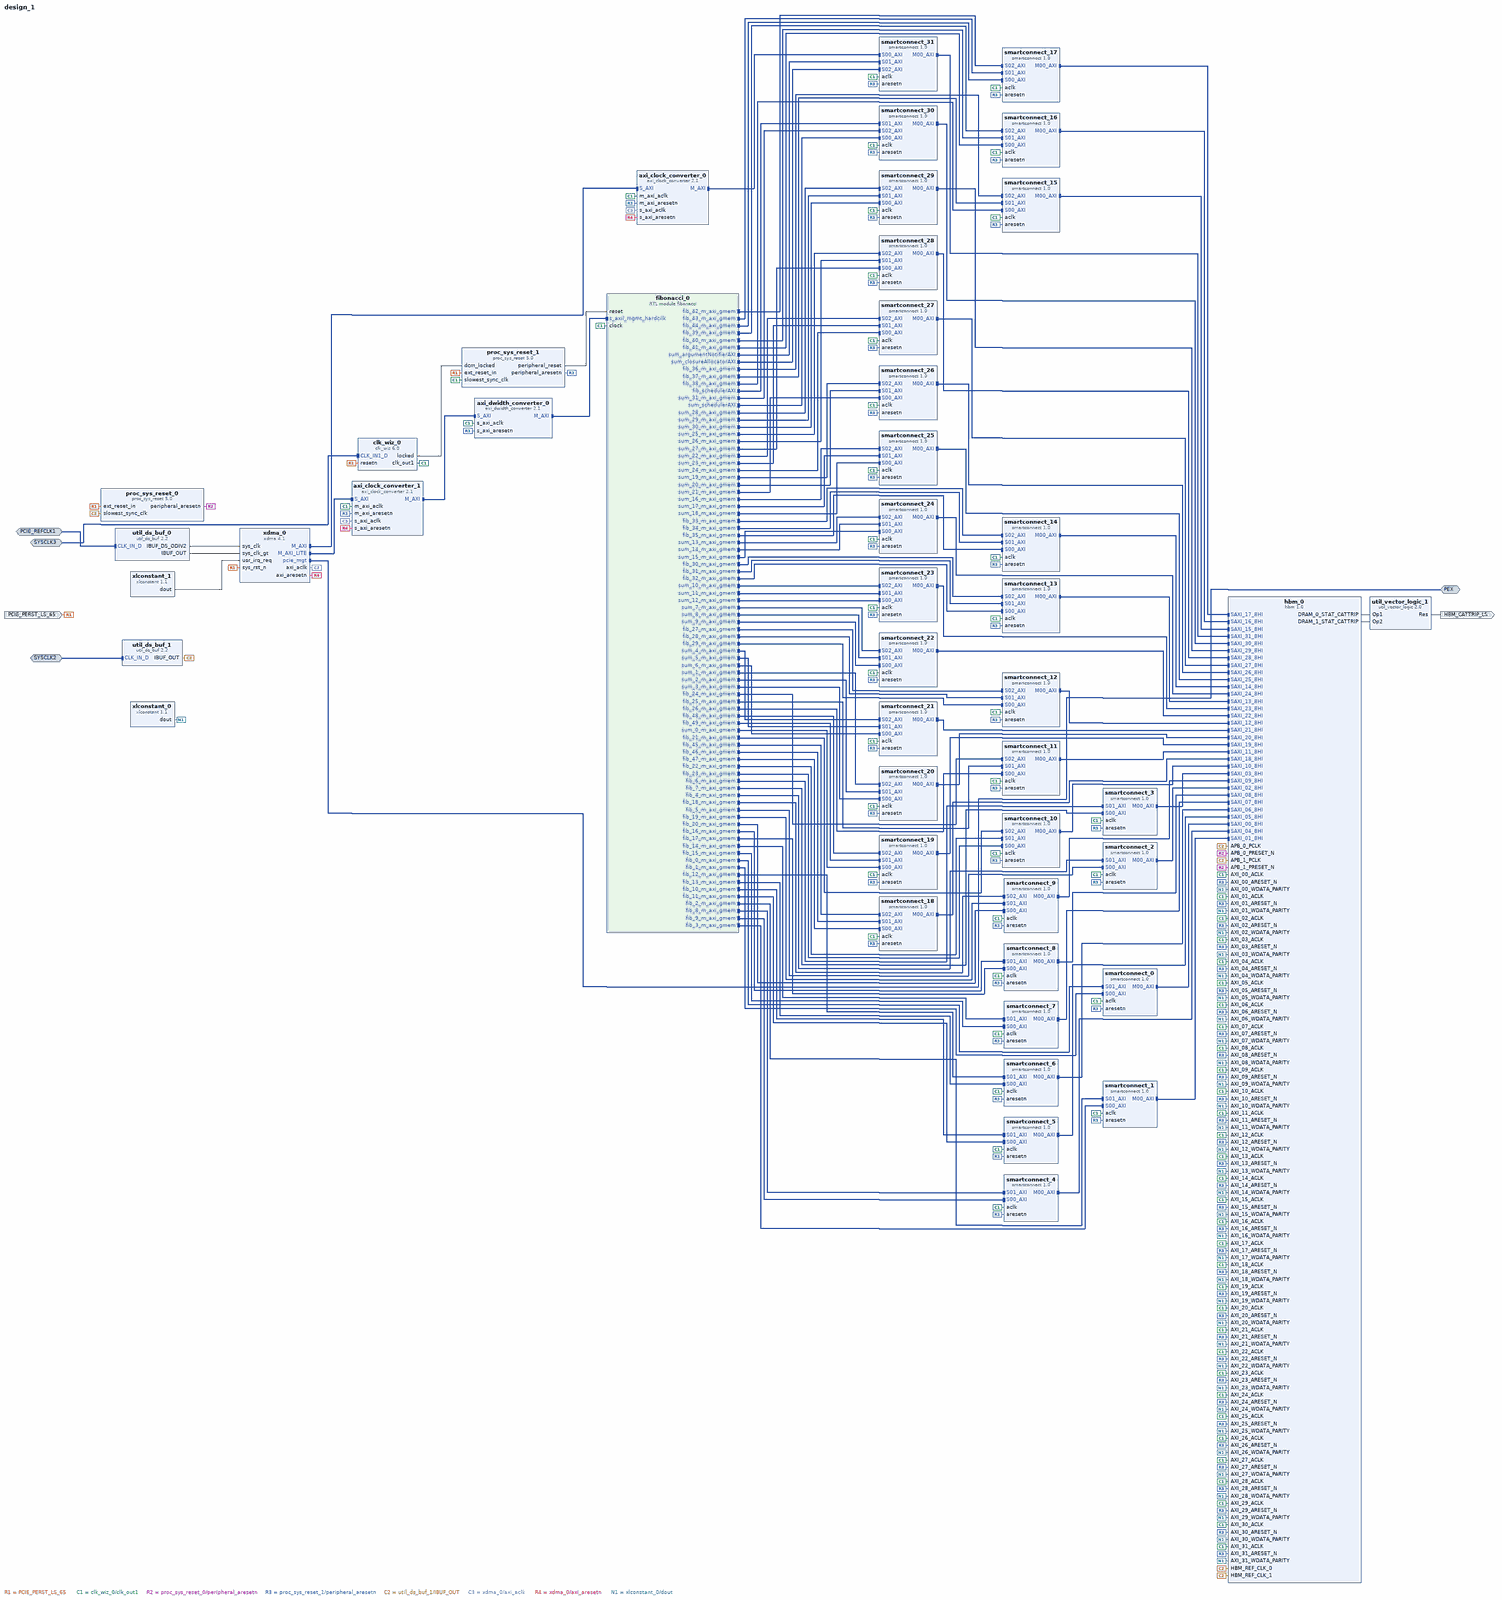
[diagram p0: block diagram of the top level, whole]
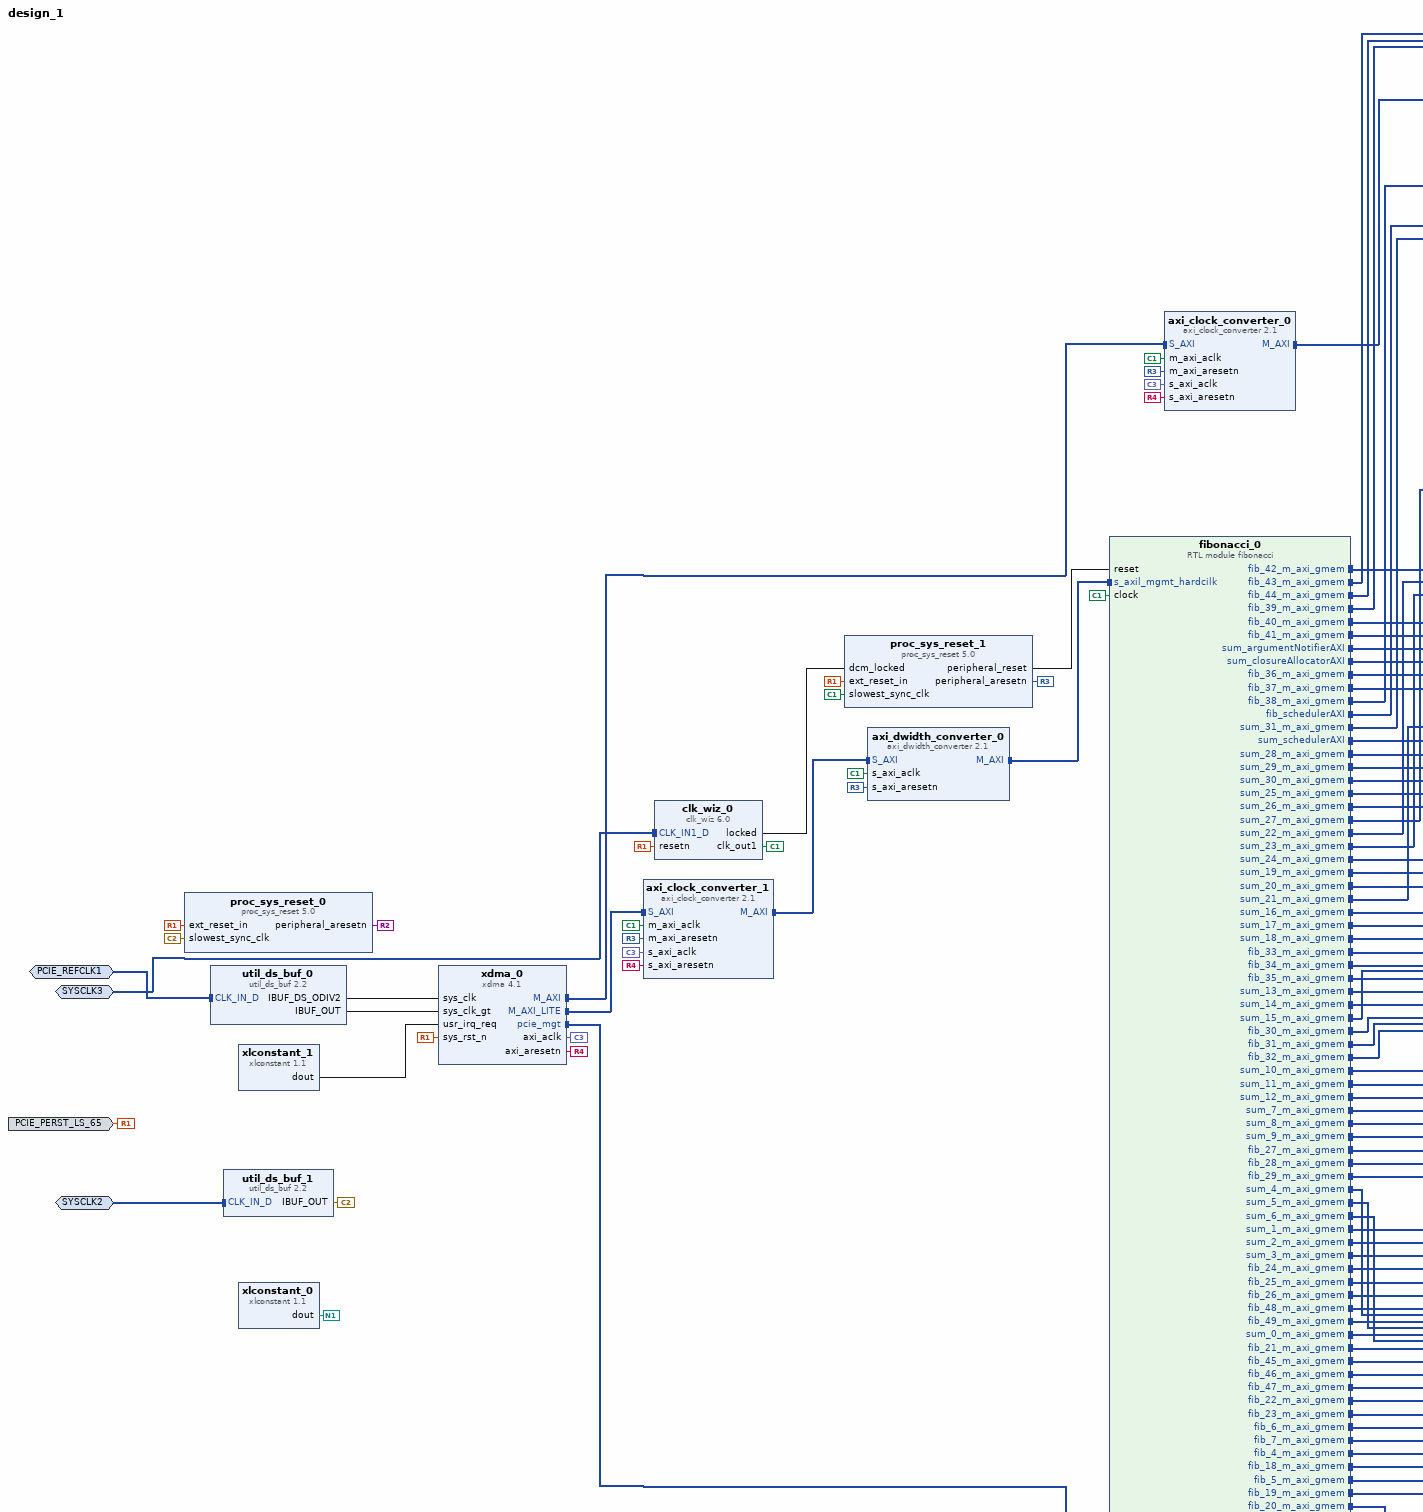
[diagram p1: block diagram of the top level, upper left part]
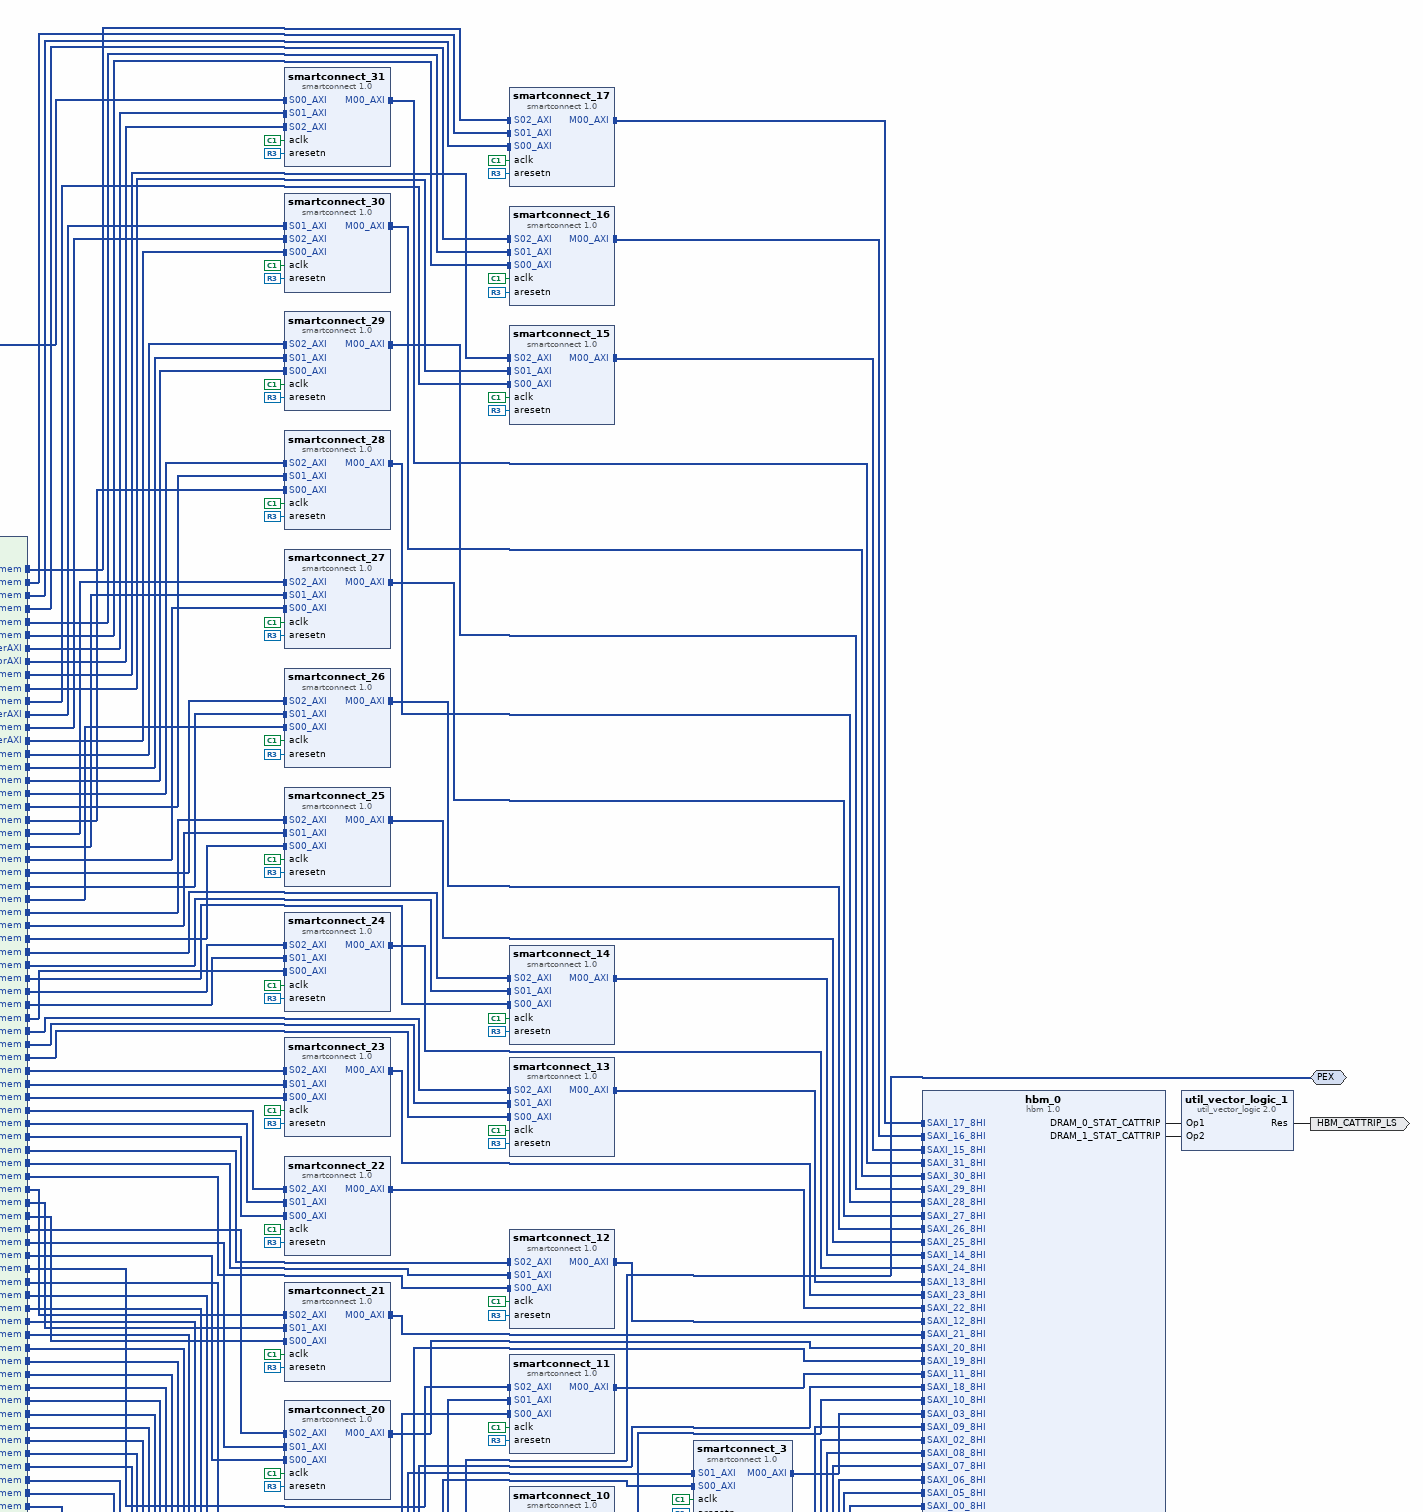
[diagram p2: block diagram of the top level, upper right part]
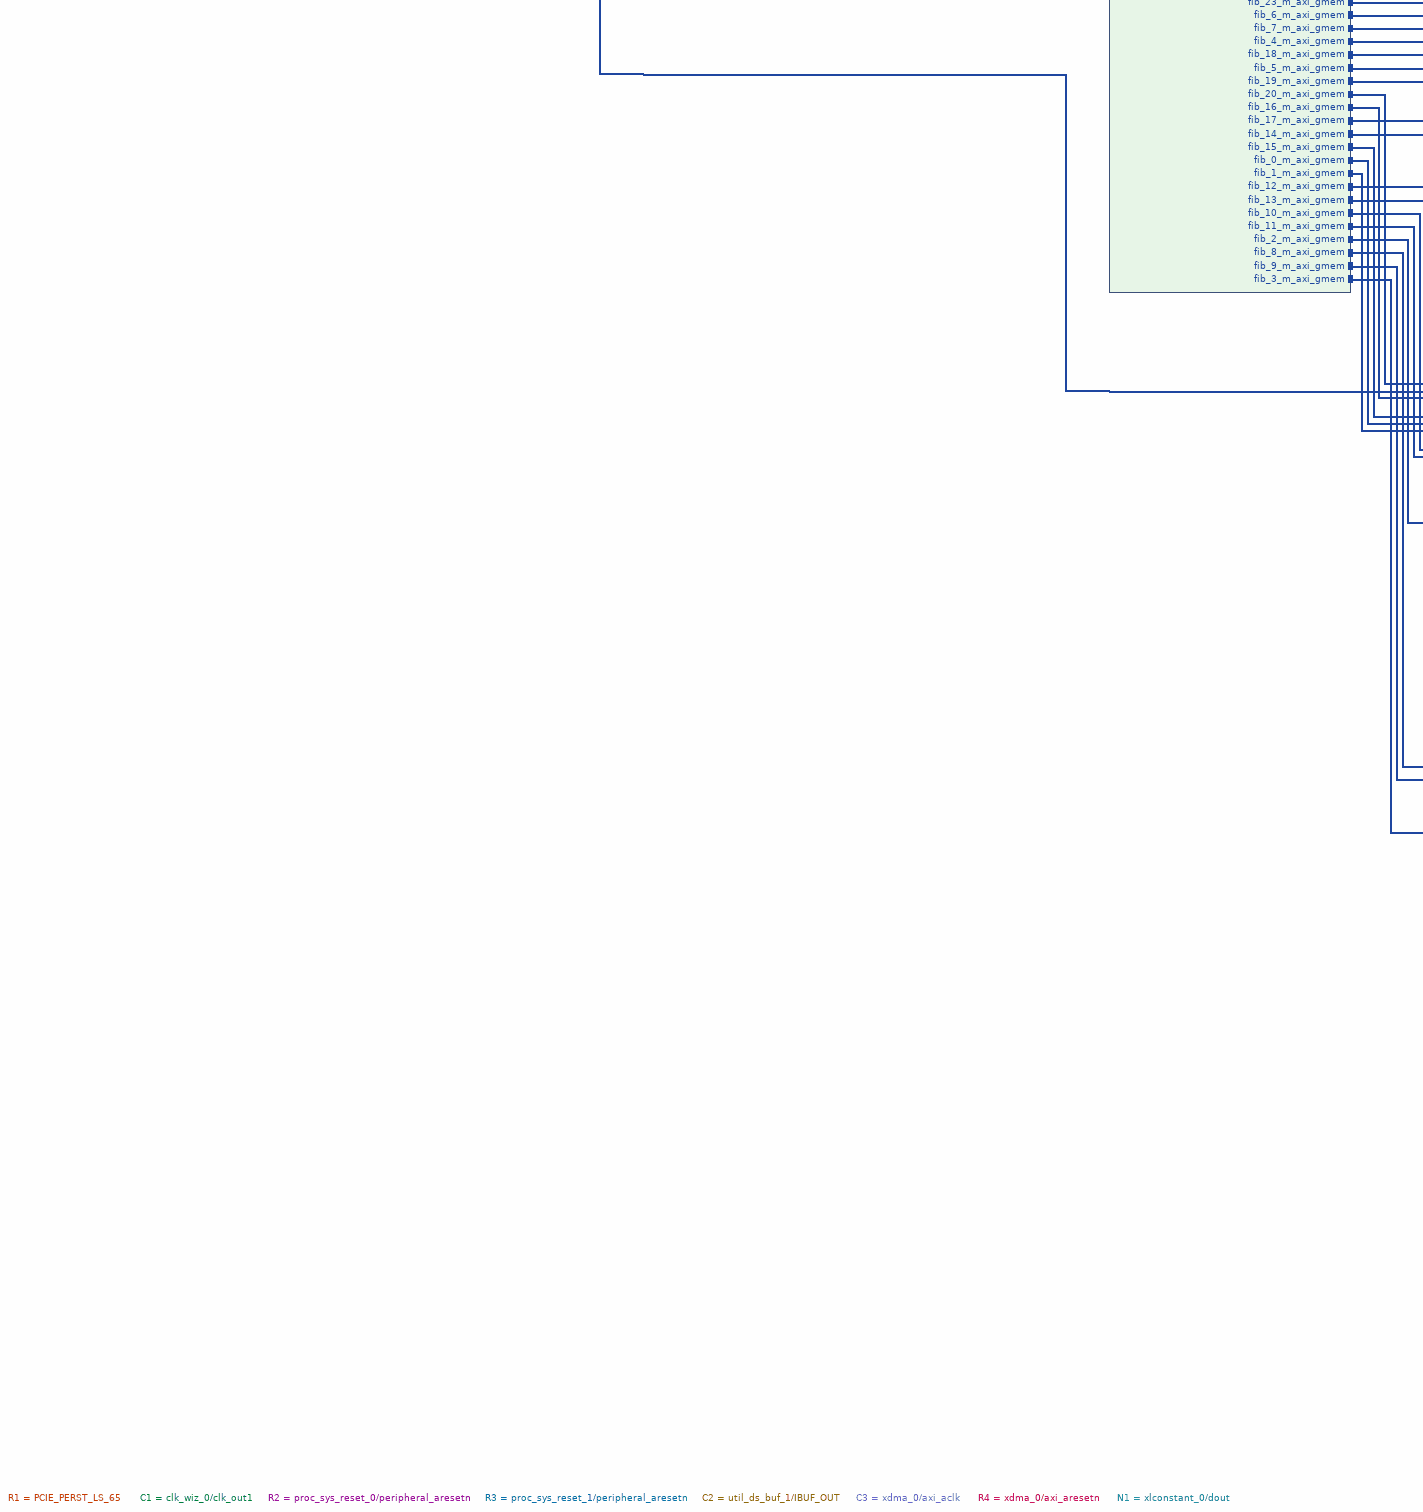
[diagram p3: block diagram of the top level, lower left part]
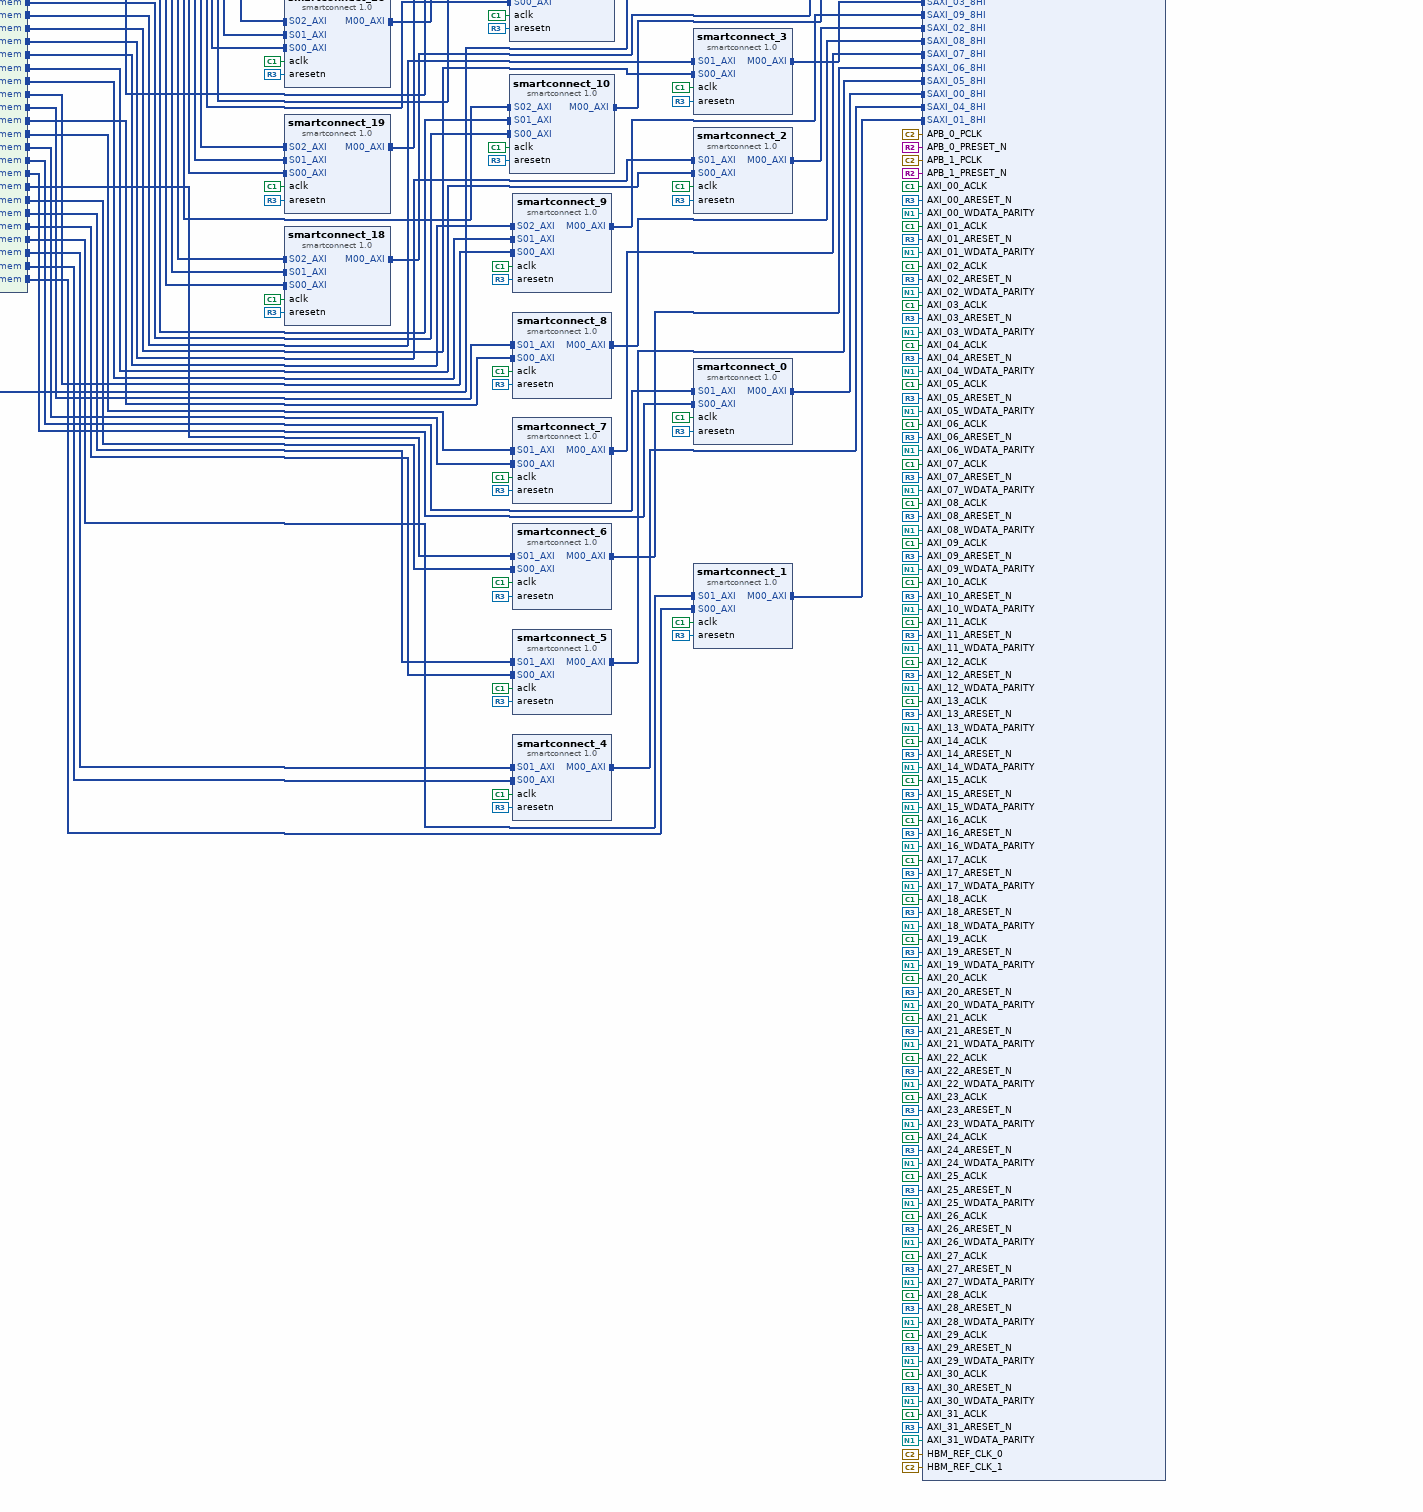
[diagram p4: block diagram of the top level, lower right part]
# Vivado block design design_1, xcu55c-fsvh2892-2L-e, Vivado 2024.1
create_bd_design design_1

create_bd_intf_port -mode Master -vlnv xilinx.com:interface:pcie_7x_mgt_rtl:1.0 PEX
create_bd_intf_port -mode Slave -vlnv xilinx.com:interface:diff_clock_rtl:1.0 PCIE_REFCLK1
create_bd_intf_port -mode Slave -vlnv xilinx.com:interface:diff_clock_rtl:1.0 SYSCLK2
create_bd_intf_port -mode Slave -vlnv xilinx.com:interface:diff_clock_rtl:1.0 SYSCLK3
create_bd_port -dir I -type rst PCIE_PERST_LS_65
create_bd_port -dir O HBM_CATTRIP_LS

create_bd_cell -type module -reference fibonacci fibonacci_0
create_bd_cell -type ip -vlnv xilinx.com:ip:xdma:4.1 xdma_0
set_property -dict [list \
  CONFIG.axil_master_64bit_en true \
  CONFIG.axilite_master_en true \
  CONFIG.axilite_master_scale Megabytes \
  CONFIG.axilite_master_size 4 \
  CONFIG.cfg_mgmt_if false \
  CONFIG.pl_link_cap_max_link_speed 8.0_GT/s \
  CONFIG.pl_link_cap_max_link_width X16 \
  CONFIG.xdma_pcie_64bit_en true \
] [get_bd_cells xdma_0]
create_bd_cell -type ip -vlnv xilinx.com:ip:xlconstant:1.1 xlconstant_1
set_property -dict {CONFIG.CONST_VAL 0} [get_bd_cells xlconstant_1]
create_bd_cell -type ip -vlnv xilinx.com:ip:util_ds_buf:2.2 util_ds_buf_0
set_property -dict {CONFIG.C_BUF_TYPE IBUFDSGTE} [get_bd_cells util_ds_buf_0]
create_bd_cell -type ip -vlnv xilinx.com:ip:axi_clock_converter:2.1 axi_clock_converter_0
create_bd_cell -type ip -vlnv xilinx.com:ip:axi_clock_converter:2.1 axi_clock_converter_1
create_bd_cell -type ip -vlnv xilinx.com:ip:hbm:1.0 hbm_0
set_property -dict [list \
  CONFIG.USER_APB_EN false \
  CONFIG.USER_HBM_DENSITY 16GB \
  CONFIG.USER_MC0_ECC_BYPASS true \
  CONFIG.USER_XSDB_INTF_EN FALSE \
] [get_bd_cells hbm_0]
create_bd_cell -type ip -vlnv xilinx.com:ip:xlconstant:1.1 xlconstant_0
set_property -dict {CONFIG.CONST_VAL 0 CONFIG.CONST_WIDTH 32} [get_bd_cells xlconstant_0]
create_bd_cell -type ip -vlnv xilinx.com:ip:util_vector_logic:2.0 util_vector_logic_1
set_property -dict {CONFIG.C_OPERATION or CONFIG.C_SIZE 1} [get_bd_cells util_vector_logic_1]
create_bd_cell -type ip -vlnv xilinx.com:ip:util_ds_buf:2.2 util_ds_buf_1
create_bd_cell -type ip -vlnv xilinx.com:ip:proc_sys_reset:5.0 proc_sys_reset_0
create_bd_cell -type ip -vlnv xilinx.com:ip:smartconnect:1.0 smartconnect_0
set_property -dict {CONFIG.NUM_SI 2} [get_bd_cells smartconnect_0]
create_bd_cell -type ip -vlnv xilinx.com:ip:smartconnect:1.0 smartconnect_1
set_property -dict {CONFIG.NUM_SI 2} [get_bd_cells smartconnect_1]
create_bd_cell -type ip -vlnv xilinx.com:ip:smartconnect:1.0 smartconnect_2
set_property -dict {CONFIG.NUM_SI 2} [get_bd_cells smartconnect_2]
create_bd_cell -type ip -vlnv xilinx.com:ip:smartconnect:1.0 smartconnect_3
set_property -dict {CONFIG.NUM_SI 2} [get_bd_cells smartconnect_3]
create_bd_cell -type ip -vlnv xilinx.com:ip:smartconnect:1.0 smartconnect_4
set_property -dict {CONFIG.NUM_SI 2} [get_bd_cells smartconnect_4]
create_bd_cell -type ip -vlnv xilinx.com:ip:smartconnect:1.0 smartconnect_5
set_property -dict {CONFIG.NUM_SI 2} [get_bd_cells smartconnect_5]
create_bd_cell -type ip -vlnv xilinx.com:ip:smartconnect:1.0 smartconnect_6
set_property -dict {CONFIG.NUM_SI 2} [get_bd_cells smartconnect_6]
create_bd_cell -type ip -vlnv xilinx.com:ip:smartconnect:1.0 smartconnect_7
set_property -dict {CONFIG.NUM_SI 2} [get_bd_cells smartconnect_7]
create_bd_cell -type ip -vlnv xilinx.com:ip:smartconnect:1.0 smartconnect_8
set_property -dict {CONFIG.NUM_SI 2} [get_bd_cells smartconnect_8]
create_bd_cell -type ip -vlnv xilinx.com:ip:smartconnect:1.0 smartconnect_9
set_property -dict {CONFIG.NUM_SI 3} [get_bd_cells smartconnect_9]
create_bd_cell -type ip -vlnv xilinx.com:ip:smartconnect:1.0 smartconnect_10
set_property -dict {CONFIG.NUM_SI 3} [get_bd_cells smartconnect_10]
create_bd_cell -type ip -vlnv xilinx.com:ip:smartconnect:1.0 smartconnect_11
set_property -dict {CONFIG.NUM_SI 3} [get_bd_cells smartconnect_11]
create_bd_cell -type ip -vlnv xilinx.com:ip:smartconnect:1.0 smartconnect_12
set_property -dict {CONFIG.NUM_SI 3} [get_bd_cells smartconnect_12]
create_bd_cell -type ip -vlnv xilinx.com:ip:smartconnect:1.0 smartconnect_13
set_property -dict {CONFIG.NUM_SI 3} [get_bd_cells smartconnect_13]
create_bd_cell -type ip -vlnv xilinx.com:ip:smartconnect:1.0 smartconnect_14
set_property -dict {CONFIG.NUM_SI 3} [get_bd_cells smartconnect_14]
create_bd_cell -type ip -vlnv xilinx.com:ip:smartconnect:1.0 smartconnect_15
set_property -dict {CONFIG.NUM_SI 3} [get_bd_cells smartconnect_15]
create_bd_cell -type ip -vlnv xilinx.com:ip:smartconnect:1.0 smartconnect_16
set_property -dict {CONFIG.NUM_SI 3} [get_bd_cells smartconnect_16]
create_bd_cell -type ip -vlnv xilinx.com:ip:smartconnect:1.0 smartconnect_17
set_property -dict {CONFIG.NUM_SI 3} [get_bd_cells smartconnect_17]
create_bd_cell -type ip -vlnv xilinx.com:ip:smartconnect:1.0 smartconnect_18
set_property -dict {CONFIG.NUM_SI 3} [get_bd_cells smartconnect_18]
create_bd_cell -type ip -vlnv xilinx.com:ip:smartconnect:1.0 smartconnect_19
set_property -dict {CONFIG.NUM_SI 3} [get_bd_cells smartconnect_19]
create_bd_cell -type ip -vlnv xilinx.com:ip:smartconnect:1.0 smartconnect_20
set_property -dict {CONFIG.NUM_SI 3} [get_bd_cells smartconnect_20]
create_bd_cell -type ip -vlnv xilinx.com:ip:smartconnect:1.0 smartconnect_21
set_property -dict {CONFIG.NUM_SI 3} [get_bd_cells smartconnect_21]
create_bd_cell -type ip -vlnv xilinx.com:ip:smartconnect:1.0 smartconnect_22
set_property -dict {CONFIG.NUM_SI 3} [get_bd_cells smartconnect_22]
create_bd_cell -type ip -vlnv xilinx.com:ip:smartconnect:1.0 smartconnect_23
set_property -dict {CONFIG.NUM_SI 3} [get_bd_cells smartconnect_23]
create_bd_cell -type ip -vlnv xilinx.com:ip:smartconnect:1.0 smartconnect_24
set_property -dict {CONFIG.NUM_SI 3} [get_bd_cells smartconnect_24]
create_bd_cell -type ip -vlnv xilinx.com:ip:smartconnect:1.0 smartconnect_25
set_property -dict {CONFIG.NUM_SI 3} [get_bd_cells smartconnect_25]
create_bd_cell -type ip -vlnv xilinx.com:ip:smartconnect:1.0 smartconnect_26
set_property -dict {CONFIG.NUM_SI 3} [get_bd_cells smartconnect_26]
create_bd_cell -type ip -vlnv xilinx.com:ip:smartconnect:1.0 smartconnect_27
set_property -dict {CONFIG.NUM_SI 3} [get_bd_cells smartconnect_27]
create_bd_cell -type ip -vlnv xilinx.com:ip:smartconnect:1.0 smartconnect_28
set_property -dict {CONFIG.NUM_SI 3} [get_bd_cells smartconnect_28]
create_bd_cell -type ip -vlnv xilinx.com:ip:smartconnect:1.0 smartconnect_29
set_property -dict {CONFIG.NUM_SI 3} [get_bd_cells smartconnect_29]
create_bd_cell -type ip -vlnv xilinx.com:ip:smartconnect:1.0 smartconnect_30
set_property -dict {CONFIG.NUM_SI 3} [get_bd_cells smartconnect_30]
create_bd_cell -type ip -vlnv xilinx.com:ip:smartconnect:1.0 smartconnect_31
set_property -dict {CONFIG.NUM_SI 3} [get_bd_cells smartconnect_31]
create_bd_cell -type ip -vlnv xilinx.com:ip:axi_dwidth_converter:2.1 axi_dwidth_converter_0
create_bd_cell -type ip -vlnv xilinx.com:ip:clk_wiz:6.0 clk_wiz_0
set_property -dict [list \
  CONFIG.CLKIN1_JITTER_PS 100.0 \
  CONFIG.CLKOUT1_DRIVES Buffer \
  CONFIG.CLKOUT1_JITTER 98.427 \
  CONFIG.CLKOUT1_PHASE_ERROR 87.466 \
  CONFIG.CLKOUT1_REQUESTED_OUT_FREQ 250.000 \
  CONFIG.CLKOUT2_DRIVES Buffer \
  CONFIG.CLKOUT3_DRIVES Buffer \
  CONFIG.CLKOUT4_DRIVES Buffer \
  CONFIG.CLKOUT5_DRIVES Buffer \
  CONFIG.CLKOUT6_DRIVES Buffer \
  CONFIG.CLKOUT7_DRIVES Buffer \
  CONFIG.ENABLE_CDDC false \
  CONFIG.ENABLE_CLOCK_MONITOR false \
  CONFIG.FEEDBACK_SOURCE FDBK_AUTO \
  CONFIG.MMCM_BANDWIDTH OPTIMIZED \
  CONFIG.MMCM_CLKFBOUT_MULT_F 11.875 \
  CONFIG.MMCM_CLKIN1_PERIOD 10.000 \
  CONFIG.MMCM_CLKOUT0_DIVIDE_F 4.750 \
  CONFIG.MMCM_COMPENSATION AUTO \
  CONFIG.MMCM_DIVCLK_DIVIDE 1 \
  CONFIG.OPTIMIZE_CLOCKING_STRUCTURE_EN false \
  CONFIG.PRIMITIVE MMCM \
  CONFIG.PRIM_SOURCE Differential_clock_capable_pin \
  CONFIG.RESET_PORT resetn \
  CONFIG.RESET_TYPE ACTIVE_LOW \
] [get_bd_cells clk_wiz_0]
create_bd_cell -type ip -vlnv xilinx.com:ip:proc_sys_reset:5.0 proc_sys_reset_1

# ---- connections ----

connect_bd_intf_net -intf_net PCIE_REFCLK1_1 [get_bd_intf_ports PCIE_REFCLK1] [get_bd_intf_pins util_ds_buf_0/CLK_IN_D]
connect_bd_intf_net -intf_net SYSCLK2_1 [get_bd_intf_ports SYSCLK2] [get_bd_intf_pins util_ds_buf_1/CLK_IN_D]
connect_bd_intf_net -intf_net SYSCLK3_1 [get_bd_intf_ports SYSCLK3] [get_bd_intf_pins clk_wiz_0/CLK_IN1_D]
connect_bd_intf_net [get_bd_intf_pins smartconnect_31/S00_AXI] [get_bd_intf_pins axi_clock_converter_0/M_AXI]
connect_bd_intf_net [get_bd_intf_pins axi_clock_converter_1/M_AXI] [get_bd_intf_pins axi_dwidth_converter_0/S_AXI]
connect_bd_intf_net [get_bd_intf_pins axi_dwidth_converter_0/M_AXI] [get_bd_intf_pins fibonacci_0/s_axil_mgmt_hardcilk]
connect_bd_intf_net [get_bd_intf_pins fibonacci_0/fib_0_m_axi_gmem] [get_bd_intf_pins smartconnect_0/S01_AXI]
connect_bd_intf_net [get_bd_intf_pins fibonacci_0/fib_10_m_axi_gmem] [get_bd_intf_pins smartconnect_5/S01_AXI]
connect_bd_intf_net [get_bd_intf_pins fibonacci_0/fib_11_m_axi_gmem] [get_bd_intf_pins smartconnect_5/S00_AXI]
connect_bd_intf_net [get_bd_intf_pins fibonacci_0/fib_12_m_axi_gmem] [get_bd_intf_pins smartconnect_6/S01_AXI]
connect_bd_intf_net [get_bd_intf_pins fibonacci_0/fib_13_m_axi_gmem] [get_bd_intf_pins smartconnect_6/S00_AXI]
connect_bd_intf_net [get_bd_intf_pins fibonacci_0/fib_14_m_axi_gmem] [get_bd_intf_pins smartconnect_7/S01_AXI]
connect_bd_intf_net [get_bd_intf_pins fibonacci_0/fib_15_m_axi_gmem] [get_bd_intf_pins smartconnect_7/S00_AXI]
connect_bd_intf_net [get_bd_intf_pins fibonacci_0/fib_16_m_axi_gmem] [get_bd_intf_pins smartconnect_8/S01_AXI]
connect_bd_intf_net [get_bd_intf_pins fibonacci_0/fib_17_m_axi_gmem] [get_bd_intf_pins smartconnect_8/S00_AXI]
connect_bd_intf_net [get_bd_intf_pins fibonacci_0/fib_18_m_axi_gmem] [get_bd_intf_pins smartconnect_9/S02_AXI]
connect_bd_intf_net [get_bd_intf_pins fibonacci_0/fib_19_m_axi_gmem] [get_bd_intf_pins smartconnect_9/S01_AXI]
connect_bd_intf_net [get_bd_intf_pins fibonacci_0/fib_1_m_axi_gmem] [get_bd_intf_pins smartconnect_0/S00_AXI]
connect_bd_intf_net [get_bd_intf_pins fibonacci_0/fib_20_m_axi_gmem] [get_bd_intf_pins smartconnect_9/S00_AXI]
connect_bd_intf_net [get_bd_intf_pins fibonacci_0/fib_21_m_axi_gmem] [get_bd_intf_pins smartconnect_10/S02_AXI]
connect_bd_intf_net [get_bd_intf_pins fibonacci_0/fib_22_m_axi_gmem] [get_bd_intf_pins smartconnect_10/S01_AXI]
connect_bd_intf_net [get_bd_intf_pins fibonacci_0/fib_23_m_axi_gmem] [get_bd_intf_pins smartconnect_10/S00_AXI]
connect_bd_intf_net [get_bd_intf_pins fibonacci_0/fib_24_m_axi_gmem] [get_bd_intf_pins smartconnect_11/S02_AXI]
connect_bd_intf_net [get_bd_intf_pins fibonacci_0/fib_25_m_axi_gmem] [get_bd_intf_pins smartconnect_11/S01_AXI]
connect_bd_intf_net [get_bd_intf_pins fibonacci_0/fib_26_m_axi_gmem] [get_bd_intf_pins smartconnect_11/S00_AXI]
connect_bd_intf_net [get_bd_intf_pins fibonacci_0/fib_27_m_axi_gmem] [get_bd_intf_pins smartconnect_12/S02_AXI]
connect_bd_intf_net [get_bd_intf_pins fibonacci_0/fib_28_m_axi_gmem] [get_bd_intf_pins smartconnect_12/S01_AXI]
connect_bd_intf_net [get_bd_intf_pins fibonacci_0/fib_29_m_axi_gmem] [get_bd_intf_pins smartconnect_12/S00_AXI]
connect_bd_intf_net [get_bd_intf_pins fibonacci_0/fib_2_m_axi_gmem] [get_bd_intf_pins smartconnect_1/S01_AXI]
connect_bd_intf_net [get_bd_intf_pins fibonacci_0/fib_30_m_axi_gmem] [get_bd_intf_pins smartconnect_13/S02_AXI]
connect_bd_intf_net [get_bd_intf_pins fibonacci_0/fib_31_m_axi_gmem] [get_bd_intf_pins smartconnect_13/S01_AXI]
connect_bd_intf_net [get_bd_intf_pins fibonacci_0/fib_32_m_axi_gmem] [get_bd_intf_pins smartconnect_13/S00_AXI]
connect_bd_intf_net [get_bd_intf_pins fibonacci_0/fib_33_m_axi_gmem] [get_bd_intf_pins smartconnect_14/S02_AXI]
connect_bd_intf_net [get_bd_intf_pins fibonacci_0/fib_34_m_axi_gmem] [get_bd_intf_pins smartconnect_14/S01_AXI]
connect_bd_intf_net [get_bd_intf_pins fibonacci_0/fib_35_m_axi_gmem] [get_bd_intf_pins smartconnect_14/S00_AXI]
connect_bd_intf_net [get_bd_intf_pins fibonacci_0/fib_36_m_axi_gmem] [get_bd_intf_pins smartconnect_15/S02_AXI]
connect_bd_intf_net [get_bd_intf_pins fibonacci_0/fib_37_m_axi_gmem] [get_bd_intf_pins smartconnect_15/S01_AXI]
connect_bd_intf_net [get_bd_intf_pins fibonacci_0/fib_38_m_axi_gmem] [get_bd_intf_pins smartconnect_15/S00_AXI]
connect_bd_intf_net [get_bd_intf_pins fibonacci_0/fib_39_m_axi_gmem] [get_bd_intf_pins smartconnect_16/S02_AXI]
connect_bd_intf_net [get_bd_intf_pins fibonacci_0/fib_3_m_axi_gmem] [get_bd_intf_pins smartconnect_1/S00_AXI]
connect_bd_intf_net [get_bd_intf_pins fibonacci_0/fib_40_m_axi_gmem] [get_bd_intf_pins smartconnect_16/S01_AXI]
connect_bd_intf_net [get_bd_intf_pins fibonacci_0/fib_41_m_axi_gmem] [get_bd_intf_pins smartconnect_16/S00_AXI]
connect_bd_intf_net [get_bd_intf_pins fibonacci_0/fib_42_m_axi_gmem] [get_bd_intf_pins smartconnect_17/S02_AXI]
connect_bd_intf_net [get_bd_intf_pins fibonacci_0/fib_43_m_axi_gmem] [get_bd_intf_pins smartconnect_17/S01_AXI]
connect_bd_intf_net [get_bd_intf_pins fibonacci_0/fib_44_m_axi_gmem] [get_bd_intf_pins smartconnect_17/S00_AXI]
connect_bd_intf_net [get_bd_intf_pins fibonacci_0/fib_45_m_axi_gmem] [get_bd_intf_pins smartconnect_18/S02_AXI]
connect_bd_intf_net [get_bd_intf_pins fibonacci_0/fib_46_m_axi_gmem] [get_bd_intf_pins smartconnect_18/S01_AXI]
connect_bd_intf_net [get_bd_intf_pins fibonacci_0/fib_47_m_axi_gmem] [get_bd_intf_pins smartconnect_18/S00_AXI]
connect_bd_intf_net [get_bd_intf_pins fibonacci_0/fib_48_m_axi_gmem] [get_bd_intf_pins smartconnect_19/S02_AXI]
connect_bd_intf_net [get_bd_intf_pins fibonacci_0/fib_49_m_axi_gmem] [get_bd_intf_pins smartconnect_19/S01_AXI]
connect_bd_intf_net [get_bd_intf_pins fibonacci_0/fib_4_m_axi_gmem] [get_bd_intf_pins smartconnect_2/S01_AXI]
connect_bd_intf_net [get_bd_intf_pins fibonacci_0/fib_5_m_axi_gmem] [get_bd_intf_pins smartconnect_2/S00_AXI]
connect_bd_intf_net [get_bd_intf_pins fibonacci_0/fib_6_m_axi_gmem] [get_bd_intf_pins smartconnect_3/S01_AXI]
connect_bd_intf_net [get_bd_intf_pins fibonacci_0/fib_7_m_axi_gmem] [get_bd_intf_pins smartconnect_3/S00_AXI]
connect_bd_intf_net [get_bd_intf_pins fibonacci_0/fib_8_m_axi_gmem] [get_bd_intf_pins smartconnect_4/S01_AXI]
connect_bd_intf_net [get_bd_intf_pins fibonacci_0/fib_9_m_axi_gmem] [get_bd_intf_pins smartconnect_4/S00_AXI]
connect_bd_intf_net [get_bd_intf_pins fibonacci_0/fib_schedulerAXI] [get_bd_intf_pins smartconnect_30/S01_AXI]
connect_bd_intf_net [get_bd_intf_pins fibonacci_0/sum_0_m_axi_gmem] [get_bd_intf_pins smartconnect_19/S00_AXI]
connect_bd_intf_net [get_bd_intf_pins fibonacci_0/sum_10_m_axi_gmem] [get_bd_intf_pins smartconnect_23/S02_AXI]
connect_bd_intf_net [get_bd_intf_pins fibonacci_0/sum_11_m_axi_gmem] [get_bd_intf_pins smartconnect_23/S01_AXI]
connect_bd_intf_net [get_bd_intf_pins fibonacci_0/sum_12_m_axi_gmem] [get_bd_intf_pins smartconnect_23/S00_AXI]
connect_bd_intf_net [get_bd_intf_pins fibonacci_0/sum_13_m_axi_gmem] [get_bd_intf_pins smartconnect_24/S02_AXI]
connect_bd_intf_net [get_bd_intf_pins fibonacci_0/sum_14_m_axi_gmem] [get_bd_intf_pins smartconnect_24/S01_AXI]
connect_bd_intf_net [get_bd_intf_pins fibonacci_0/sum_15_m_axi_gmem] [get_bd_intf_pins smartconnect_24/S00_AXI]
connect_bd_intf_net [get_bd_intf_pins fibonacci_0/sum_16_m_axi_gmem] [get_bd_intf_pins smartconnect_25/S02_AXI]
connect_bd_intf_net [get_bd_intf_pins fibonacci_0/sum_17_m_axi_gmem] [get_bd_intf_pins smartconnect_25/S01_AXI]
connect_bd_intf_net [get_bd_intf_pins fibonacci_0/sum_18_m_axi_gmem] [get_bd_intf_pins smartconnect_25/S00_AXI]
connect_bd_intf_net [get_bd_intf_pins fibonacci_0/sum_19_m_axi_gmem] [get_bd_intf_pins smartconnect_26/S02_AXI]
connect_bd_intf_net [get_bd_intf_pins fibonacci_0/sum_1_m_axi_gmem] [get_bd_intf_pins smartconnect_20/S02_AXI]
connect_bd_intf_net [get_bd_intf_pins fibonacci_0/sum_20_m_axi_gmem] [get_bd_intf_pins smartconnect_26/S01_AXI]
connect_bd_intf_net [get_bd_intf_pins fibonacci_0/sum_21_m_axi_gmem] [get_bd_intf_pins smartconnect_26/S00_AXI]
connect_bd_intf_net [get_bd_intf_pins fibonacci_0/sum_22_m_axi_gmem] [get_bd_intf_pins smartconnect_27/S02_AXI]
connect_bd_intf_net [get_bd_intf_pins fibonacci_0/sum_23_m_axi_gmem] [get_bd_intf_pins smartconnect_27/S01_AXI]
connect_bd_intf_net [get_bd_intf_pins fibonacci_0/sum_24_m_axi_gmem] [get_bd_intf_pins smartconnect_27/S00_AXI]
connect_bd_intf_net [get_bd_intf_pins fibonacci_0/sum_25_m_axi_gmem] [get_bd_intf_pins smartconnect_28/S02_AXI]
connect_bd_intf_net [get_bd_intf_pins fibonacci_0/sum_26_m_axi_gmem] [get_bd_intf_pins smartconnect_28/S01_AXI]
connect_bd_intf_net [get_bd_intf_pins fibonacci_0/sum_27_m_axi_gmem] [get_bd_intf_pins smartconnect_28/S00_AXI]
connect_bd_intf_net [get_bd_intf_pins fibonacci_0/sum_28_m_axi_gmem] [get_bd_intf_pins smartconnect_29/S02_AXI]
connect_bd_intf_net [get_bd_intf_pins fibonacci_0/sum_29_m_axi_gmem] [get_bd_intf_pins smartconnect_29/S01_AXI]
connect_bd_intf_net [get_bd_intf_pins fibonacci_0/sum_2_m_axi_gmem] [get_bd_intf_pins smartconnect_20/S01_AXI]
connect_bd_intf_net [get_bd_intf_pins fibonacci_0/sum_30_m_axi_gmem] [get_bd_intf_pins smartconnect_29/S00_AXI]
connect_bd_intf_net [get_bd_intf_pins fibonacci_0/sum_31_m_axi_gmem] [get_bd_intf_pins smartconnect_30/S02_AXI]
connect_bd_intf_net [get_bd_intf_pins fibonacci_0/sum_3_m_axi_gmem] [get_bd_intf_pins smartconnect_20/S00_AXI]
connect_bd_intf_net [get_bd_intf_pins fibonacci_0/sum_4_m_axi_gmem] [get_bd_intf_pins smartconnect_21/S02_AXI]
connect_bd_intf_net [get_bd_intf_pins fibonacci_0/sum_5_m_axi_gmem] [get_bd_intf_pins smartconnect_21/S01_AXI]
connect_bd_intf_net [get_bd_intf_pins fibonacci_0/sum_6_m_axi_gmem] [get_bd_intf_pins smartconnect_21/S00_AXI]
connect_bd_intf_net [get_bd_intf_pins fibonacci_0/sum_7_m_axi_gmem] [get_bd_intf_pins smartconnect_22/S02_AXI]
connect_bd_intf_net [get_bd_intf_pins fibonacci_0/sum_8_m_axi_gmem] [get_bd_intf_pins smartconnect_22/S01_AXI]
connect_bd_intf_net [get_bd_intf_pins fibonacci_0/sum_9_m_axi_gmem] [get_bd_intf_pins smartconnect_22/S00_AXI]
connect_bd_intf_net [get_bd_intf_pins fibonacci_0/sum_argumentNotifierAXI] [get_bd_intf_pins smartconnect_31/S01_AXI]
connect_bd_intf_net [get_bd_intf_pins fibonacci_0/sum_closureAllocatorAXI] [get_bd_intf_pins smartconnect_31/S02_AXI]
connect_bd_intf_net [get_bd_intf_pins fibonacci_0/sum_schedulerAXI] [get_bd_intf_pins smartconnect_30/S00_AXI]
connect_bd_intf_net [get_bd_intf_pins smartconnect_0/M00_AXI] [get_bd_intf_pins hbm_0/SAXI_00_8HI]
connect_bd_intf_net [get_bd_intf_pins smartconnect_10/M00_AXI] [get_bd_intf_pins hbm_0/SAXI_10_8HI]
connect_bd_intf_net [get_bd_intf_pins smartconnect_11/M00_AXI] [get_bd_intf_pins hbm_0/SAXI_11_8HI]
connect_bd_intf_net [get_bd_intf_pins smartconnect_12/M00_AXI] [get_bd_intf_pins hbm_0/SAXI_12_8HI]
connect_bd_intf_net [get_bd_intf_pins smartconnect_13/M00_AXI] [get_bd_intf_pins hbm_0/SAXI_13_8HI]
connect_bd_intf_net [get_bd_intf_pins smartconnect_14/M00_AXI] [get_bd_intf_pins hbm_0/SAXI_14_8HI]
connect_bd_intf_net [get_bd_intf_pins smartconnect_15/M00_AXI] [get_bd_intf_pins hbm_0/SAXI_15_8HI]
connect_bd_intf_net [get_bd_intf_pins smartconnect_16/M00_AXI] [get_bd_intf_pins hbm_0/SAXI_16_8HI]
connect_bd_intf_net [get_bd_intf_pins smartconnect_17/M00_AXI] [get_bd_intf_pins hbm_0/SAXI_17_8HI]
connect_bd_intf_net [get_bd_intf_pins smartconnect_18/M00_AXI] [get_bd_intf_pins hbm_0/SAXI_18_8HI]
connect_bd_intf_net [get_bd_intf_pins smartconnect_19/M00_AXI] [get_bd_intf_pins hbm_0/SAXI_19_8HI]
connect_bd_intf_net [get_bd_intf_pins smartconnect_1/M00_AXI] [get_bd_intf_pins hbm_0/SAXI_01_8HI]
connect_bd_intf_net [get_bd_intf_pins smartconnect_20/M00_AXI] [get_bd_intf_pins hbm_0/SAXI_20_8HI]
connect_bd_intf_net [get_bd_intf_pins smartconnect_21/M00_AXI] [get_bd_intf_pins hbm_0/SAXI_21_8HI]
connect_bd_intf_net [get_bd_intf_pins smartconnect_22/M00_AXI] [get_bd_intf_pins hbm_0/SAXI_22_8HI]
connect_bd_intf_net [get_bd_intf_pins smartconnect_23/M00_AXI] [get_bd_intf_pins hbm_0/SAXI_23_8HI]
connect_bd_intf_net [get_bd_intf_pins smartconnect_24/M00_AXI] [get_bd_intf_pins hbm_0/SAXI_24_8HI]
connect_bd_intf_net [get_bd_intf_pins smartconnect_25/M00_AXI] [get_bd_intf_pins hbm_0/SAXI_25_8HI]
connect_bd_intf_net [get_bd_intf_pins smartconnect_26/M00_AXI] [get_bd_intf_pins hbm_0/SAXI_26_8HI]
connect_bd_intf_net [get_bd_intf_pins smartconnect_27/M00_AXI] [get_bd_intf_pins hbm_0/SAXI_27_8HI]
connect_bd_intf_net [get_bd_intf_pins smartconnect_28/M00_AXI] [get_bd_intf_pins hbm_0/SAXI_28_8HI]
connect_bd_intf_net [get_bd_intf_pins smartconnect_29/M00_AXI] [get_bd_intf_pins hbm_0/SAXI_29_8HI]
connect_bd_intf_net [get_bd_intf_pins smartconnect_2/M00_AXI] [get_bd_intf_pins hbm_0/SAXI_02_8HI]
connect_bd_intf_net [get_bd_intf_pins smartconnect_30/M00_AXI] [get_bd_intf_pins hbm_0/SAXI_30_8HI]
connect_bd_intf_net [get_bd_intf_pins smartconnect_31/M00_AXI] [get_bd_intf_pins hbm_0/SAXI_31_8HI]
connect_bd_intf_net [get_bd_intf_pins smartconnect_3/M00_AXI] [get_bd_intf_pins hbm_0/SAXI_03_8HI]
connect_bd_intf_net [get_bd_intf_pins smartconnect_4/M00_AXI] [get_bd_intf_pins hbm_0/SAXI_04_8HI]
connect_bd_intf_net [get_bd_intf_pins smartconnect_5/M00_AXI] [get_bd_intf_pins hbm_0/SAXI_05_8HI]
connect_bd_intf_net [get_bd_intf_pins smartconnect_6/M00_AXI] [get_bd_intf_pins hbm_0/SAXI_06_8HI]
connect_bd_intf_net [get_bd_intf_pins smartconnect_7/M00_AXI] [get_bd_intf_pins hbm_0/SAXI_07_8HI]
connect_bd_intf_net [get_bd_intf_pins smartconnect_8/M00_AXI] [get_bd_intf_pins hbm_0/SAXI_08_8HI]
connect_bd_intf_net [get_bd_intf_pins smartconnect_9/M00_AXI] [get_bd_intf_pins hbm_0/SAXI_09_8HI]
connect_bd_intf_net [get_bd_intf_pins xdma_0/M_AXI] [get_bd_intf_pins axi_clock_converter_0/S_AXI]
connect_bd_intf_net [get_bd_intf_pins xdma_0/M_AXI_LITE] [get_bd_intf_pins axi_clock_converter_1/S_AXI]
connect_bd_intf_net [get_bd_intf_ports PEX] [get_bd_intf_pins xdma_0/pcie_mgt]
connect_bd_net -net PCIE_PERST_LS_65_1 [get_bd_ports PCIE_PERST_LS_65] \
  [get_bd_pins xdma_0/sys_rst_n] [get_bd_pins proc_sys_reset_0/ext_reset_in] [get_bd_pins clk_wiz_0/resetn] \
  [get_bd_pins proc_sys_reset_1/ext_reset_in]
connect_bd_net [get_bd_pins clk_wiz_0/clk_out1] \
  [get_bd_pins hbm_0/AXI_00_ACLK] [get_bd_pins hbm_0/AXI_01_ACLK] [get_bd_pins hbm_0/AXI_02_ACLK] \
  [get_bd_pins hbm_0/AXI_03_ACLK] [get_bd_pins hbm_0/AXI_04_ACLK] [get_bd_pins hbm_0/AXI_05_ACLK] \
  [get_bd_pins hbm_0/AXI_06_ACLK] [get_bd_pins hbm_0/AXI_07_ACLK] [get_bd_pins hbm_0/AXI_08_ACLK] \
  [get_bd_pins hbm_0/AXI_09_ACLK] [get_bd_pins hbm_0/AXI_10_ACLK] [get_bd_pins hbm_0/AXI_11_ACLK] \
  [get_bd_pins hbm_0/AXI_12_ACLK] [get_bd_pins hbm_0/AXI_13_ACLK] [get_bd_pins hbm_0/AXI_14_ACLK] \
  [get_bd_pins hbm_0/AXI_15_ACLK] [get_bd_pins hbm_0/AXI_16_ACLK] [get_bd_pins hbm_0/AXI_17_ACLK] \
  [get_bd_pins hbm_0/AXI_18_ACLK] [get_bd_pins hbm_0/AXI_19_ACLK] [get_bd_pins hbm_0/AXI_20_ACLK] \
  [get_bd_pins hbm_0/AXI_21_ACLK] [get_bd_pins hbm_0/AXI_22_ACLK] [get_bd_pins hbm_0/AXI_23_ACLK] \
  [get_bd_pins hbm_0/AXI_24_ACLK] [get_bd_pins hbm_0/AXI_25_ACLK] [get_bd_pins hbm_0/AXI_26_ACLK] \
  [get_bd_pins hbm_0/AXI_27_ACLK] [get_bd_pins hbm_0/AXI_28_ACLK] [get_bd_pins hbm_0/AXI_29_ACLK] \
  [get_bd_pins hbm_0/AXI_30_ACLK] [get_bd_pins hbm_0/AXI_31_ACLK] [get_bd_pins fibonacci_0/clock] \
  [get_bd_pins axi_clock_converter_0/m_axi_aclk] [get_bd_pins axi_clock_converter_1/m_axi_aclk] \
  [get_bd_pins proc_sys_reset_1/slowest_sync_clk] [get_bd_pins smartconnect_0/aclk] [get_bd_pins smartconnect_1/aclk] \
  [get_bd_pins smartconnect_10/aclk] [get_bd_pins smartconnect_11/aclk] [get_bd_pins smartconnect_12/aclk] \
  [get_bd_pins smartconnect_13/aclk] [get_bd_pins smartconnect_14/aclk] [get_bd_pins smartconnect_15/aclk] \
  [get_bd_pins smartconnect_16/aclk] [get_bd_pins smartconnect_17/aclk] [get_bd_pins smartconnect_18/aclk] \
  [get_bd_pins smartconnect_19/aclk] [get_bd_pins smartconnect_2/aclk] [get_bd_pins smartconnect_20/aclk] \
  [get_bd_pins smartconnect_21/aclk] [get_bd_pins smartconnect_22/aclk] [get_bd_pins smartconnect_23/aclk] \
  [get_bd_pins smartconnect_24/aclk] [get_bd_pins smartconnect_25/aclk] [get_bd_pins smartconnect_26/aclk] \
  [get_bd_pins smartconnect_27/aclk] [get_bd_pins smartconnect_28/aclk] [get_bd_pins smartconnect_29/aclk] \
  [get_bd_pins smartconnect_3/aclk] [get_bd_pins smartconnect_30/aclk] [get_bd_pins smartconnect_31/aclk] \
  [get_bd_pins smartconnect_4/aclk] [get_bd_pins smartconnect_5/aclk] [get_bd_pins smartconnect_6/aclk] \
  [get_bd_pins smartconnect_7/aclk] [get_bd_pins smartconnect_8/aclk] [get_bd_pins smartconnect_9/aclk] \
  [get_bd_pins axi_dwidth_converter_0/s_axi_aclk]
connect_bd_net [get_bd_pins clk_wiz_0/locked] [get_bd_pins proc_sys_reset_1/dcm_locked]
connect_bd_net [get_bd_pins hbm_0/DRAM_0_STAT_CATTRIP] [get_bd_pins util_vector_logic_1/Op1]
connect_bd_net [get_bd_pins hbm_0/DRAM_1_STAT_CATTRIP] [get_bd_pins util_vector_logic_1/Op2]
connect_bd_net [get_bd_pins proc_sys_reset_0/peripheral_aresetn] [get_bd_pins hbm_0/APB_0_PRESET_N] [get_bd_pins hbm_0/APB_1_PRESET_N]
connect_bd_net [get_bd_pins proc_sys_reset_1/peripheral_aresetn] \
  [get_bd_pins hbm_0/AXI_00_ARESET_N] [get_bd_pins hbm_0/AXI_01_ARESET_N] [get_bd_pins hbm_0/AXI_02_ARESET_N] \
  [get_bd_pins hbm_0/AXI_03_ARESET_N] [get_bd_pins hbm_0/AXI_04_ARESET_N] [get_bd_pins hbm_0/AXI_05_ARESET_N] \
  [get_bd_pins hbm_0/AXI_06_ARESET_N] [get_bd_pins hbm_0/AXI_07_ARESET_N] [get_bd_pins hbm_0/AXI_08_ARESET_N] \
  [get_bd_pins hbm_0/AXI_09_ARESET_N] [get_bd_pins hbm_0/AXI_10_ARESET_N] [get_bd_pins hbm_0/AXI_11_ARESET_N] \
  [get_bd_pins hbm_0/AXI_12_ARESET_N] [get_bd_pins hbm_0/AXI_13_ARESET_N] [get_bd_pins hbm_0/AXI_14_ARESET_N] \
  [get_bd_pins hbm_0/AXI_15_ARESET_N] [get_bd_pins hbm_0/AXI_16_ARESET_N] [get_bd_pins hbm_0/AXI_17_ARESET_N] \
  [get_bd_pins hbm_0/AXI_18_ARESET_N] [get_bd_pins hbm_0/AXI_19_ARESET_N] [get_bd_pins hbm_0/AXI_20_ARESET_N] \
  [get_bd_pins hbm_0/AXI_21_ARESET_N] [get_bd_pins hbm_0/AXI_22_ARESET_N] [get_bd_pins hbm_0/AXI_23_ARESET_N] \
  [get_bd_pins hbm_0/AXI_24_ARESET_N] [get_bd_pins hbm_0/AXI_25_ARESET_N] [get_bd_pins hbm_0/AXI_26_ARESET_N] \
  [get_bd_pins hbm_0/AXI_27_ARESET_N] [get_bd_pins hbm_0/AXI_28_ARESET_N] [get_bd_pins hbm_0/AXI_29_ARESET_N] \
  [get_bd_pins hbm_0/AXI_30_ARESET_N] [get_bd_pins hbm_0/AXI_31_ARESET_N] [get_bd_pins axi_clock_converter_0/m_axi_aresetn] \
  [get_bd_pins axi_clock_converter_1/m_axi_aresetn] [get_bd_pins smartconnect_0/aresetn] [get_bd_pins smartconnect_1/aresetn] \
  [get_bd_pins smartconnect_10/aresetn] [get_bd_pins smartconnect_11/aresetn] [get_bd_pins smartconnect_12/aresetn] \
  [get_bd_pins smartconnect_13/aresetn] [get_bd_pins smartconnect_14/aresetn] [get_bd_pins smartconnect_15/aresetn] \
  [get_bd_pins smartconnect_16/aresetn] [get_bd_pins smartconnect_17/aresetn] [get_bd_pins smartconnect_18/aresetn] \
  [get_bd_pins smartconnect_19/aresetn] [get_bd_pins smartconnect_2/aresetn] [get_bd_pins smartconnect_20/aresetn] \
  [get_bd_pins smartconnect_21/aresetn] [get_bd_pins smartconnect_22/aresetn] [get_bd_pins smartconnect_23/aresetn] \
  [get_bd_pins smartconnect_24/aresetn] [get_bd_pins smartconnect_25/aresetn] [get_bd_pins smartconnect_26/aresetn] \
  [get_bd_pins smartconnect_27/aresetn] [get_bd_pins smartconnect_28/aresetn] [get_bd_pins smartconnect_29/aresetn] \
  [get_bd_pins smartconnect_3/aresetn] [get_bd_pins smartconnect_30/aresetn] [get_bd_pins smartconnect_31/aresetn] \
  [get_bd_pins smartconnect_4/aresetn] [get_bd_pins smartconnect_5/aresetn] [get_bd_pins smartconnect_6/aresetn] \
  [get_bd_pins smartconnect_7/aresetn] [get_bd_pins smartconnect_8/aresetn] [get_bd_pins smartconnect_9/aresetn] \
  [get_bd_pins axi_dwidth_converter_0/s_axi_aresetn]
connect_bd_net [get_bd_pins proc_sys_reset_1/peripheral_reset] [get_bd_pins fibonacci_0/reset]
connect_bd_net [get_bd_pins util_ds_buf_0/IBUF_DS_ODIV2] [get_bd_pins xdma_0/sys_clk]
connect_bd_net [get_bd_pins util_ds_buf_0/IBUF_OUT] [get_bd_pins xdma_0/sys_clk_gt]
connect_bd_net [get_bd_pins util_ds_buf_1/IBUF_OUT] \
  [get_bd_pins hbm_0/HBM_REF_CLK_0] [get_bd_pins hbm_0/HBM_REF_CLK_1] [get_bd_pins hbm_0/APB_0_PCLK] \
  [get_bd_pins hbm_0/APB_1_PCLK] [get_bd_pins proc_sys_reset_0/slowest_sync_clk]
connect_bd_net [get_bd_pins util_vector_logic_1/Res] [get_bd_ports HBM_CATTRIP_LS]
connect_bd_net [get_bd_pins xdma_0/axi_aclk] [get_bd_pins axi_clock_converter_0/s_axi_aclk] [get_bd_pins axi_clock_converter_1/s_axi_aclk]
connect_bd_net [get_bd_pins xdma_0/axi_aresetn] [get_bd_pins axi_clock_converter_0/s_axi_aresetn] [get_bd_pins axi_clock_converter_1/s_axi_aresetn]
connect_bd_net [get_bd_pins xlconstant_0/dout] \
  [get_bd_pins hbm_0/AXI_00_WDATA_PARITY] [get_bd_pins hbm_0/AXI_01_WDATA_PARITY] [get_bd_pins hbm_0/AXI_02_WDATA_PARITY] \
  [get_bd_pins hbm_0/AXI_03_WDATA_PARITY] [get_bd_pins hbm_0/AXI_04_WDATA_PARITY] [get_bd_pins hbm_0/AXI_05_WDATA_PARITY] \
  [get_bd_pins hbm_0/AXI_06_WDATA_PARITY] [get_bd_pins hbm_0/AXI_07_WDATA_PARITY] [get_bd_pins hbm_0/AXI_08_WDATA_PARITY] \
  [get_bd_pins hbm_0/AXI_09_WDATA_PARITY] [get_bd_pins hbm_0/AXI_10_WDATA_PARITY] [get_bd_pins hbm_0/AXI_11_WDATA_PARITY] \
  [get_bd_pins hbm_0/AXI_12_WDATA_PARITY] [get_bd_pins hbm_0/AXI_13_WDATA_PARITY] [get_bd_pins hbm_0/AXI_14_WDATA_PARITY] \
  [get_bd_pins hbm_0/AXI_15_WDATA_PARITY] [get_bd_pins hbm_0/AXI_16_WDATA_PARITY] [get_bd_pins hbm_0/AXI_17_WDATA_PARITY] \
  [get_bd_pins hbm_0/AXI_18_WDATA_PARITY] [get_bd_pins hbm_0/AXI_19_WDATA_PARITY] [get_bd_pins hbm_0/AXI_20_WDATA_PARITY] \
  [get_bd_pins hbm_0/AXI_21_WDATA_PARITY] [get_bd_pins hbm_0/AXI_22_WDATA_PARITY] [get_bd_pins hbm_0/AXI_23_WDATA_PARITY] \
  [get_bd_pins hbm_0/AXI_24_WDATA_PARITY] [get_bd_pins hbm_0/AXI_25_WDATA_PARITY] [get_bd_pins hbm_0/AXI_26_WDATA_PARITY] \
  [get_bd_pins hbm_0/AXI_27_WDATA_PARITY] [get_bd_pins hbm_0/AXI_28_WDATA_PARITY] [get_bd_pins hbm_0/AXI_29_WDATA_PARITY] \
  [get_bd_pins hbm_0/AXI_30_WDATA_PARITY] [get_bd_pins hbm_0/AXI_31_WDATA_PARITY]
connect_bd_net [get_bd_pins xlconstant_1/dout] [get_bd_pins xdma_0/usr_irq_req]

# ---- address map ----
assign_bd_address -offset 0x0000000000000000 -range 512M -target_address_space [get_bd_addr_spaces fibonacci_0/fib_0_m_axi_gmem] [get_bd_addr_segs hbm_0/SAXI_00_8HI/HBM_MEM00]
assign_bd_address -offset 0x0000000020000000 -range 512M -target_address_space [get_bd_addr_spaces fibonacci_0/fib_0_m_axi_gmem] [get_bd_addr_segs hbm_0/SAXI_00_8HI/HBM_MEM01]
assign_bd_address -offset 0x0000000040000000 -range 512M -target_address_space [get_bd_addr_spaces fibonacci_0/fib_0_m_axi_gmem] [get_bd_addr_segs hbm_0/SAXI_00_8HI/HBM_MEM02]
assign_bd_address -offset 0x0000000060000000 -range 512M -target_address_space [get_bd_addr_spaces fibonacci_0/fib_0_m_axi_gmem] [get_bd_addr_segs hbm_0/SAXI_00_8HI/HBM_MEM03]
assign_bd_address -offset 0x0000000080000000 -range 512M -target_address_space [get_bd_addr_spaces fibonacci_0/fib_0_m_axi_gmem] [get_bd_addr_segs hbm_0/SAXI_00_8HI/HBM_MEM04]
assign_bd_address -offset 0x00000000A0000000 -range 512M -target_address_space [get_bd_addr_spaces fibonacci_0/fib_0_m_axi_gmem] [get_bd_addr_segs hbm_0/SAXI_00_8HI/HBM_MEM05]
assign_bd_address -offset 0x00000000C0000000 -range 512M -target_address_space [get_bd_addr_spaces fibonacci_0/fib_0_m_axi_gmem] [get_bd_addr_segs hbm_0/SAXI_00_8HI/HBM_MEM06]
assign_bd_address -offset 0x00000000E0000000 -range 512M -target_address_space [get_bd_addr_spaces fibonacci_0/fib_0_m_axi_gmem] [get_bd_addr_segs hbm_0/SAXI_00_8HI/HBM_MEM07]
assign_bd_address -offset 0x0000000100000000 -range 512M -target_address_space [get_bd_addr_spaces fibonacci_0/fib_0_m_axi_gmem] [get_bd_addr_segs hbm_0/SAXI_00_8HI/HBM_MEM08]
assign_bd_address -offset 0x0000000120000000 -range 512M -target_address_space [get_bd_addr_spaces fibonacci_0/fib_0_m_axi_gmem] [get_bd_addr_segs hbm_0/SAXI_00_8HI/HBM_MEM09]
assign_bd_address -offset 0x0000000140000000 -range 512M -target_address_space [get_bd_addr_spaces fibonacci_0/fib_0_m_axi_gmem] [get_bd_addr_segs hbm_0/SAXI_00_8HI/HBM_MEM10]
assign_bd_address -offset 0x0000000160000000 -range 512M -target_address_space [get_bd_addr_spaces fibonacci_0/fib_0_m_axi_gmem] [get_bd_addr_segs hbm_0/SAXI_00_8HI/HBM_MEM11]
assign_bd_address -offset 0x0000000180000000 -range 512M -target_address_space [get_bd_addr_spaces fibonacci_0/fib_0_m_axi_gmem] [get_bd_addr_segs hbm_0/SAXI_00_8HI/HBM_MEM12]
assign_bd_address -offset 0x00000001A0000000 -range 512M -target_address_space [get_bd_addr_spaces fibonacci_0/fib_0_m_axi_gmem] [get_bd_addr_segs hbm_0/SAXI_00_8HI/HBM_MEM13]
assign_bd_address -offset 0x00000001C0000000 -range 512M -target_address_space [get_bd_addr_spaces fibonacci_0/fib_0_m_axi_gmem] [get_bd_addr_segs hbm_0/SAXI_00_8HI/HBM_MEM14]
assign_bd_address -offset 0x00000001E0000000 -range 512M -target_address_space [get_bd_addr_spaces fibonacci_0/fib_0_m_axi_gmem] [get_bd_addr_segs hbm_0/SAXI_00_8HI/HBM_MEM15]
assign_bd_address -offset 0x0000000200000000 -range 512M -target_address_space [get_bd_addr_spaces fibonacci_0/fib_0_m_axi_gmem] [get_bd_addr_segs hbm_0/SAXI_00_8HI/HBM_MEM16]
assign_bd_address -offset 0x0000000220000000 -range 512M -target_address_space [get_bd_addr_spaces fibonacci_0/fib_0_m_axi_gmem] [get_bd_addr_segs hbm_0/SAXI_00_8HI/HBM_MEM17]
assign_bd_address -offset 0x0000000240000000 -range 512M -target_address_space [get_bd_addr_spaces fibonacci_0/fib_0_m_axi_gmem] [get_bd_addr_segs hbm_0/SAXI_00_8HI/HBM_MEM18]
assign_bd_address -offset 0x0000000260000000 -range 512M -target_address_space [get_bd_addr_spaces fibonacci_0/fib_0_m_axi_gmem] [get_bd_addr_segs hbm_0/SAXI_00_8HI/HBM_MEM19]
assign_bd_address -offset 0x0000000280000000 -range 512M -target_address_space [get_bd_addr_spaces fibonacci_0/fib_0_m_axi_gmem] [get_bd_addr_segs hbm_0/SAXI_00_8HI/HBM_MEM20]
assign_bd_address -offset 0x00000002A0000000 -range 512M -target_address_space [get_bd_addr_spaces fibonacci_0/fib_0_m_axi_gmem] [get_bd_addr_segs hbm_0/SAXI_00_8HI/HBM_MEM21]
assign_bd_address -offset 0x00000002C0000000 -range 512M -target_address_space [get_bd_addr_spaces fibonacci_0/fib_0_m_axi_gmem] [get_bd_addr_segs hbm_0/SAXI_00_8HI/HBM_MEM22]
assign_bd_address -offset 0x00000002E0000000 -range 512M -target_address_space [get_bd_addr_spaces fibonacci_0/fib_0_m_axi_gmem] [get_bd_addr_segs hbm_0/SAXI_00_8HI/HBM_MEM23]
assign_bd_address -offset 0x0000000300000000 -range 512M -target_address_space [get_bd_addr_spaces fibonacci_0/fib_0_m_axi_gmem] [get_bd_addr_segs hbm_0/SAXI_00_8HI/HBM_MEM24]
assign_bd_address -offset 0x0000000320000000 -range 512M -target_address_space [get_bd_addr_spaces fibonacci_0/fib_0_m_axi_gmem] [get_bd_addr_segs hbm_0/SAXI_00_8HI/HBM_MEM25]
assign_bd_address -offset 0x0000000340000000 -range 512M -target_address_space [get_bd_addr_spaces fibonacci_0/fib_0_m_axi_gmem] [get_bd_addr_segs hbm_0/SAXI_00_8HI/HBM_MEM26]
assign_bd_address -offset 0x0000000360000000 -range 512M -target_address_space [get_bd_addr_spaces fibonacci_0/fib_0_m_axi_gmem] [get_bd_addr_segs hbm_0/SAXI_00_8HI/HBM_MEM27]
assign_bd_address -offset 0x0000000380000000 -range 512M -target_address_space [get_bd_addr_spaces fibonacci_0/fib_0_m_axi_gmem] [get_bd_addr_segs hbm_0/SAXI_00_8HI/HBM_MEM28]
assign_bd_address -offset 0x00000003A0000000 -range 512M -target_address_space [get_bd_addr_spaces fibonacci_0/fib_0_m_axi_gmem] [get_bd_addr_segs hbm_0/SAXI_00_8HI/HBM_MEM29]
assign_bd_address -offset 0x00000003C0000000 -range 512M -target_address_space [get_bd_addr_spaces fibonacci_0/fib_0_m_axi_gmem] [get_bd_addr_segs hbm_0/SAXI_00_8HI/HBM_MEM30]
assign_bd_address -offset 0x00000003E0000000 -range 512M -target_address_space [get_bd_addr_spaces fibonacci_0/fib_0_m_axi_gmem] [get_bd_addr_segs hbm_0/SAXI_00_8HI/HBM_MEM31]
assign_bd_address -offset 0x0000000000000000 -range 512M -target_address_space [get_bd_addr_spaces fibonacci_0/fib_1_m_axi_gmem] [get_bd_addr_segs hbm_0/SAXI_00_8HI/HBM_MEM00]
assign_bd_address -offset 0x0000000020000000 -range 512M -target_address_space [get_bd_addr_spaces fibonacci_0/fib_1_m_axi_gmem] [get_bd_addr_segs hbm_0/SAXI_00_8HI/HBM_MEM01]
assign_bd_address -offset 0x0000000040000000 -range 512M -target_address_space [get_bd_addr_spaces fibonacci_0/fib_1_m_axi_gmem] [get_bd_addr_segs hbm_0/SAXI_00_8HI/HBM_MEM02]
assign_bd_address -offset 0x0000000060000000 -range 512M -target_address_space [get_bd_addr_spaces fibonacci_0/fib_1_m_axi_gmem] [get_bd_addr_segs hbm_0/SAXI_00_8HI/HBM_MEM03]
assign_bd_address -offset 0x0000000080000000 -range 512M -target_address_space [get_bd_addr_spaces fibonacci_0/fib_1_m_axi_gmem] [get_bd_addr_segs hbm_0/SAXI_00_8HI/HBM_MEM04]
assign_bd_address -offset 0x00000000A0000000 -range 512M -target_address_space [get_bd_addr_spaces fibonacci_0/fib_1_m_axi_gmem] [get_bd_addr_segs hbm_0/SAXI_00_8HI/HBM_MEM05]
assign_bd_address -offset 0x00000000C0000000 -range 512M -target_address_space [get_bd_addr_spaces fibonacci_0/fib_1_m_axi_gmem] [get_bd_addr_segs hbm_0/SAXI_00_8HI/HBM_MEM06]
assign_bd_address -offset 0x00000000E0000000 -range 512M -target_address_space [get_bd_addr_spaces fibonacci_0/fib_1_m_axi_gmem] [get_bd_addr_segs hbm_0/SAXI_00_8HI/HBM_MEM07]
assign_bd_address -offset 0x0000000100000000 -range 512M -target_address_space [get_bd_addr_spaces fibonacci_0/fib_1_m_axi_gmem] [get_bd_addr_segs hbm_0/SAXI_00_8HI/HBM_MEM08]
assign_bd_address -offset 0x0000000120000000 -range 512M -target_address_space [get_bd_addr_spaces fibonacci_0/fib_1_m_axi_gmem] [get_bd_addr_segs hbm_0/SAXI_00_8HI/HBM_MEM09]
assign_bd_address -offset 0x0000000140000000 -range 512M -target_address_space [get_bd_addr_spaces fibonacci_0/fib_1_m_axi_gmem] [get_bd_addr_segs hbm_0/SAXI_00_8HI/HBM_MEM10]
assign_bd_address -offset 0x0000000160000000 -range 512M -target_address_space [get_bd_addr_spaces fibonacci_0/fib_1_m_axi_gmem] [get_bd_addr_segs hbm_0/SAXI_00_8HI/HBM_MEM11]
assign_bd_address -offset 0x0000000180000000 -range 512M -target_address_space [get_bd_addr_spaces fibonacci_0/fib_1_m_axi_gmem] [get_bd_addr_segs hbm_0/SAXI_00_8HI/HBM_MEM12]
assign_bd_address -offset 0x00000001A0000000 -range 512M -target_address_space [get_bd_addr_spaces fibonacci_0/fib_1_m_axi_gmem] [get_bd_addr_segs hbm_0/SAXI_00_8HI/HBM_MEM13]
assign_bd_address -offset 0x00000001C0000000 -range 512M -target_address_space [get_bd_addr_spaces fibonacci_0/fib_1_m_axi_gmem] [get_bd_addr_segs hbm_0/SAXI_00_8HI/HBM_MEM14]
assign_bd_address -offset 0x00000001E0000000 -range 512M -target_address_space [get_bd_addr_spaces fibonacci_0/fib_1_m_axi_gmem] [get_bd_addr_segs hbm_0/SAXI_00_8HI/HBM_MEM15]
assign_bd_address -offset 0x0000000200000000 -range 512M -target_address_space [get_bd_addr_spaces fibonacci_0/fib_1_m_axi_gmem] [get_bd_addr_segs hbm_0/SAXI_00_8HI/HBM_MEM16]
assign_bd_address -offset 0x0000000220000000 -range 512M -target_address_space [get_bd_addr_spaces fibonacci_0/fib_1_m_axi_gmem] [get_bd_addr_segs hbm_0/SAXI_00_8HI/HBM_MEM17]
assign_bd_address -offset 0x0000000240000000 -range 512M -target_address_space [get_bd_addr_spaces fibonacci_0/fib_1_m_axi_gmem] [get_bd_addr_segs hbm_0/SAXI_00_8HI/HBM_MEM18]
assign_bd_address -offset 0x0000000260000000 -range 512M -target_address_space [get_bd_addr_spaces fibonacci_0/fib_1_m_axi_gmem] [get_bd_addr_segs hbm_0/SAXI_00_8HI/HBM_MEM19]
assign_bd_address -offset 0x0000000280000000 -range 512M -target_address_space [get_bd_addr_spaces fibonacci_0/fib_1_m_axi_gmem] [get_bd_addr_segs hbm_0/SAXI_00_8HI/HBM_MEM20]
assign_bd_address -offset 0x00000002A0000000 -range 512M -target_address_space [get_bd_addr_spaces fibonacci_0/fib_1_m_axi_gmem] [get_bd_addr_segs hbm_0/SAXI_00_8HI/HBM_MEM21]
assign_bd_address -offset 0x00000002C0000000 -range 512M -target_address_space [get_bd_addr_spaces fibonacci_0/fib_1_m_axi_gmem] [get_bd_addr_segs hbm_0/SAXI_00_8HI/HBM_MEM22]
assign_bd_address -offset 0x00000002E0000000 -range 512M -target_address_space [get_bd_addr_spaces fibonacci_0/fib_1_m_axi_gmem] [get_bd_addr_segs hbm_0/SAXI_00_8HI/HBM_MEM23]
assign_bd_address -offset 0x0000000300000000 -range 512M -target_address_space [get_bd_addr_spaces fibonacci_0/fib_1_m_axi_gmem] [get_bd_addr_segs hbm_0/SAXI_00_8HI/HBM_MEM24]
assign_bd_address -offset 0x0000000320000000 -range 512M -target_address_space [get_bd_addr_spaces fibonacci_0/fib_1_m_axi_gmem] [get_bd_addr_segs hbm_0/SAXI_00_8HI/HBM_MEM25]
assign_bd_address -offset 0x0000000340000000 -range 512M -target_address_space [get_bd_addr_spaces fibonacci_0/fib_1_m_axi_gmem] [get_bd_addr_segs hbm_0/SAXI_00_8HI/HBM_MEM26]
assign_bd_address -offset 0x0000000360000000 -range 512M -target_address_space [get_bd_addr_spaces fibonacci_0/fib_1_m_axi_gmem] [get_bd_addr_segs hbm_0/SAXI_00_8HI/HBM_MEM27]
assign_bd_address -offset 0x0000000380000000 -range 512M -target_address_space [get_bd_addr_spaces fibonacci_0/fib_1_m_axi_gmem] [get_bd_addr_segs hbm_0/SAXI_00_8HI/HBM_MEM28]
assign_bd_address -offset 0x00000003A0000000 -range 512M -target_address_space [get_bd_addr_spaces fibonacci_0/fib_1_m_axi_gmem] [get_bd_addr_segs hbm_0/SAXI_00_8HI/HBM_MEM29]
assign_bd_address -offset 0x00000003C0000000 -range 512M -target_address_space [get_bd_addr_spaces fibonacci_0/fib_1_m_axi_gmem] [get_bd_addr_segs hbm_0/SAXI_00_8HI/HBM_MEM30]
assign_bd_address -offset 0x00000003E0000000 -range 512M -target_address_space [get_bd_addr_spaces fibonacci_0/fib_1_m_axi_gmem] [get_bd_addr_segs hbm_0/SAXI_00_8HI/HBM_MEM31]
assign_bd_address -offset 0x0000000000000000 -range 512M -target_address_space [get_bd_addr_spaces fibonacci_0/fib_2_m_axi_gmem] [get_bd_addr_segs hbm_0/SAXI_01_8HI/HBM_MEM00]
assign_bd_address -offset 0x0000000020000000 -range 512M -target_address_space [get_bd_addr_spaces fibonacci_0/fib_2_m_axi_gmem] [get_bd_addr_segs hbm_0/SAXI_01_8HI/HBM_MEM01]
assign_bd_address -offset 0x0000000040000000 -range 512M -target_address_space [get_bd_addr_spaces fibonacci_0/fib_2_m_axi_gmem] [get_bd_addr_segs hbm_0/SAXI_01_8HI/HBM_MEM02]
assign_bd_address -offset 0x0000000060000000 -range 512M -target_address_space [get_bd_addr_spaces fibonacci_0/fib_2_m_axi_gmem] [get_bd_addr_segs hbm_0/SAXI_01_8HI/HBM_MEM03]
assign_bd_address -offset 0x0000000080000000 -range 512M -target_address_space [get_bd_addr_spaces fibonacci_0/fib_2_m_axi_gmem] [get_bd_addr_segs hbm_0/SAXI_01_8HI/HBM_MEM04]
assign_bd_address -offset 0x00000000A0000000 -range 512M -target_address_space [get_bd_addr_spaces fibonacci_0/fib_2_m_axi_gmem] [get_bd_addr_segs hbm_0/SAXI_01_8HI/HBM_MEM05]
assign_bd_address -offset 0x00000000C0000000 -range 512M -target_address_space [get_bd_addr_spaces fibonacci_0/fib_2_m_axi_gmem] [get_bd_addr_segs hbm_0/SAXI_01_8HI/HBM_MEM06]
assign_bd_address -offset 0x00000000E0000000 -range 512M -target_address_space [get_bd_addr_spaces fibonacci_0/fib_2_m_axi_gmem] [get_bd_addr_segs hbm_0/SAXI_01_8HI/HBM_MEM07]
assign_bd_address -offset 0x0000000100000000 -range 512M -target_address_space [get_bd_addr_spaces fibonacci_0/fib_2_m_axi_gmem] [get_bd_addr_segs hbm_0/SAXI_01_8HI/HBM_MEM08]
assign_bd_address -offset 0x0000000120000000 -range 512M -target_address_space [get_bd_addr_spaces fibonacci_0/fib_2_m_axi_gmem] [get_bd_addr_segs hbm_0/SAXI_01_8HI/HBM_MEM09]
assign_bd_address -offset 0x0000000140000000 -range 512M -target_address_space [get_bd_addr_spaces fibonacci_0/fib_2_m_axi_gmem] [get_bd_addr_segs hbm_0/SAXI_01_8HI/HBM_MEM10]
assign_bd_address -offset 0x0000000160000000 -range 512M -target_address_space [get_bd_addr_spaces fibonacci_0/fib_2_m_axi_gmem] [get_bd_addr_segs hbm_0/SAXI_01_8HI/HBM_MEM11]
assign_bd_address -offset 0x0000000180000000 -range 512M -target_address_space [get_bd_addr_spaces fibonacci_0/fib_2_m_axi_gmem] [get_bd_addr_segs hbm_0/SAXI_01_8HI/HBM_MEM12]
assign_bd_address -offset 0x00000001A0000000 -range 512M -target_address_space [get_bd_addr_spaces fibonacci_0/fib_2_m_axi_gmem] [get_bd_addr_segs hbm_0/SAXI_01_8HI/HBM_MEM13]
assign_bd_address -offset 0x00000001C0000000 -range 512M -target_address_space [get_bd_addr_spaces fibonacci_0/fib_2_m_axi_gmem] [get_bd_addr_segs hbm_0/SAXI_01_8HI/HBM_MEM14]
assign_bd_address -offset 0x00000001E0000000 -range 512M -target_address_space [get_bd_addr_spaces fibonacci_0/fib_2_m_axi_gmem] [get_bd_addr_segs hbm_0/SAXI_01_8HI/HBM_MEM15]
assign_bd_address -offset 0x0000000200000000 -range 512M -target_address_space [get_bd_addr_spaces fibonacci_0/fib_2_m_axi_gmem] [get_bd_addr_segs hbm_0/SAXI_01_8HI/HBM_MEM16]
assign_bd_address -offset 0x0000000220000000 -range 512M -target_address_space [get_bd_addr_spaces fibonacci_0/fib_2_m_axi_gmem] [get_bd_addr_segs hbm_0/SAXI_01_8HI/HBM_MEM17]
assign_bd_address -offset 0x0000000240000000 -range 512M -target_address_space [get_bd_addr_spaces fibonacci_0/fib_2_m_axi_gmem] [get_bd_addr_segs hbm_0/SAXI_01_8HI/HBM_MEM18]
assign_bd_address -offset 0x0000000260000000 -range 512M -target_address_space [get_bd_addr_spaces fibonacci_0/fib_2_m_axi_gmem] [get_bd_addr_segs hbm_0/SAXI_01_8HI/HBM_MEM19]
assign_bd_address -offset 0x0000000280000000 -range 512M -target_address_space [get_bd_addr_spaces fibonacci_0/fib_2_m_axi_gmem] [get_bd_addr_segs hbm_0/SAXI_01_8HI/HBM_MEM20]
assign_bd_address -offset 0x00000002A0000000 -range 512M -target_address_space [get_bd_addr_spaces fibonacci_0/fib_2_m_axi_gmem] [get_bd_addr_segs hbm_0/SAXI_01_8HI/HBM_MEM21]
assign_bd_address -offset 0x00000002C0000000 -range 512M -target_address_space [get_bd_addr_spaces fibonacci_0/fib_2_m_axi_gmem] [get_bd_addr_segs hbm_0/SAXI_01_8HI/HBM_MEM22]
assign_bd_address -offset 0x00000002E0000000 -range 512M -target_address_space [get_bd_addr_spaces fibonacci_0/fib_2_m_axi_gmem] [get_bd_addr_segs hbm_0/SAXI_01_8HI/HBM_MEM23]
assign_bd_address -offset 0x0000000300000000 -range 512M -target_address_space [get_bd_addr_spaces fibonacci_0/fib_2_m_axi_gmem] [get_bd_addr_segs hbm_0/SAXI_01_8HI/HBM_MEM24]
assign_bd_address -offset 0x0000000320000000 -range 512M -target_address_space [get_bd_addr_spaces fibonacci_0/fib_2_m_axi_gmem] [get_bd_addr_segs hbm_0/SAXI_01_8HI/HBM_MEM25]
assign_bd_address -offset 0x0000000340000000 -range 512M -target_address_space [get_bd_addr_spaces fibonacci_0/fib_2_m_axi_gmem] [get_bd_addr_segs hbm_0/SAXI_01_8HI/HBM_MEM26]
assign_bd_address -offset 0x0000000360000000 -range 512M -target_address_space [get_bd_addr_spaces fibonacci_0/fib_2_m_axi_gmem] [get_bd_addr_segs hbm_0/SAXI_01_8HI/HBM_MEM27]
assign_bd_address -offset 0x0000000380000000 -range 512M -target_address_space [get_bd_addr_spaces fibonacci_0/fib_2_m_axi_gmem] [get_bd_addr_segs hbm_0/SAXI_01_8HI/HBM_MEM28]
assign_bd_address -offset 0x00000003A0000000 -range 512M -target_address_space [get_bd_addr_spaces fibonacci_0/fib_2_m_axi_gmem] [get_bd_addr_segs hbm_0/SAXI_01_8HI/HBM_MEM29]
assign_bd_address -offset 0x00000003C0000000 -range 512M -target_address_space [get_bd_addr_spaces fibonacci_0/fib_2_m_axi_gmem] [get_bd_addr_segs hbm_0/SAXI_01_8HI/HBM_MEM30]
assign_bd_address -offset 0x00000003E0000000 -range 512M -target_address_space [get_bd_addr_spaces fibonacci_0/fib_2_m_axi_gmem] [get_bd_addr_segs hbm_0/SAXI_01_8HI/HBM_MEM31]
assign_bd_address -offset 0x0000000000000000 -range 512M -target_address_space [get_bd_addr_spaces fibonacci_0/fib_3_m_axi_gmem] [get_bd_addr_segs hbm_0/SAXI_01_8HI/HBM_MEM00]
assign_bd_address -offset 0x0000000020000000 -range 512M -target_address_space [get_bd_addr_spaces fibonacci_0/fib_3_m_axi_gmem] [get_bd_addr_segs hbm_0/SAXI_01_8HI/HBM_MEM01]
assign_bd_address -offset 0x0000000040000000 -range 512M -target_address_space [get_bd_addr_spaces fibonacci_0/fib_3_m_axi_gmem] [get_bd_addr_segs hbm_0/SAXI_01_8HI/HBM_MEM02]
assign_bd_address -offset 0x0000000060000000 -range 512M -target_address_space [get_bd_addr_spaces fibonacci_0/fib_3_m_axi_gmem] [get_bd_addr_segs hbm_0/SAXI_01_8HI/HBM_MEM03]
assign_bd_address -offset 0x0000000080000000 -range 512M -target_address_space [get_bd_addr_spaces fibonacci_0/fib_3_m_axi_gmem] [get_bd_addr_segs hbm_0/SAXI_01_8HI/HBM_MEM04]
assign_bd_address -offset 0x00000000A0000000 -range 512M -target_address_space [get_bd_addr_spaces fibonacci_0/fib_3_m_axi_gmem] [get_bd_addr_segs hbm_0/SAXI_01_8HI/HBM_MEM05]
assign_bd_address -offset 0x00000000C0000000 -range 512M -target_address_space [get_bd_addr_spaces fibonacci_0/fib_3_m_axi_gmem] [get_bd_addr_segs hbm_0/SAXI_01_8HI/HBM_MEM06]
assign_bd_address -offset 0x00000000E0000000 -range 512M -target_address_space [get_bd_addr_spaces fibonacci_0/fib_3_m_axi_gmem] [get_bd_addr_segs hbm_0/SAXI_01_8HI/HBM_MEM07]
assign_bd_address -offset 0x0000000100000000 -range 512M -target_address_space [get_bd_addr_spaces fibonacci_0/fib_3_m_axi_gmem] [get_bd_addr_segs hbm_0/SAXI_01_8HI/HBM_MEM08]
assign_bd_address -offset 0x0000000120000000 -range 512M -target_address_space [get_bd_addr_spaces fibonacci_0/fib_3_m_axi_gmem] [get_bd_addr_segs hbm_0/SAXI_01_8HI/HBM_MEM09]
assign_bd_address -offset 0x0000000140000000 -range 512M -target_address_space [get_bd_addr_spaces fibonacci_0/fib_3_m_axi_gmem] [get_bd_addr_segs hbm_0/SAXI_01_8HI/HBM_MEM10]
assign_bd_address -offset 0x0000000160000000 -range 512M -target_address_space [get_bd_addr_spaces fibonacci_0/fib_3_m_axi_gmem] [get_bd_addr_segs hbm_0/SAXI_01_8HI/HBM_MEM11]
assign_bd_address -offset 0x0000000180000000 -range 512M -target_address_space [get_bd_addr_spaces fibonacci_0/fib_3_m_axi_gmem] [get_bd_addr_segs hbm_0/SAXI_01_8HI/HBM_MEM12]
assign_bd_address -offset 0x00000001A0000000 -range 512M -target_address_space [get_bd_addr_spaces fibonacci_0/fib_3_m_axi_gmem] [get_bd_addr_segs hbm_0/SAXI_01_8HI/HBM_MEM13]
